# EAGLE design Transconductance Card (EAGLE 9.6.2)

## Sheet 1 of 4
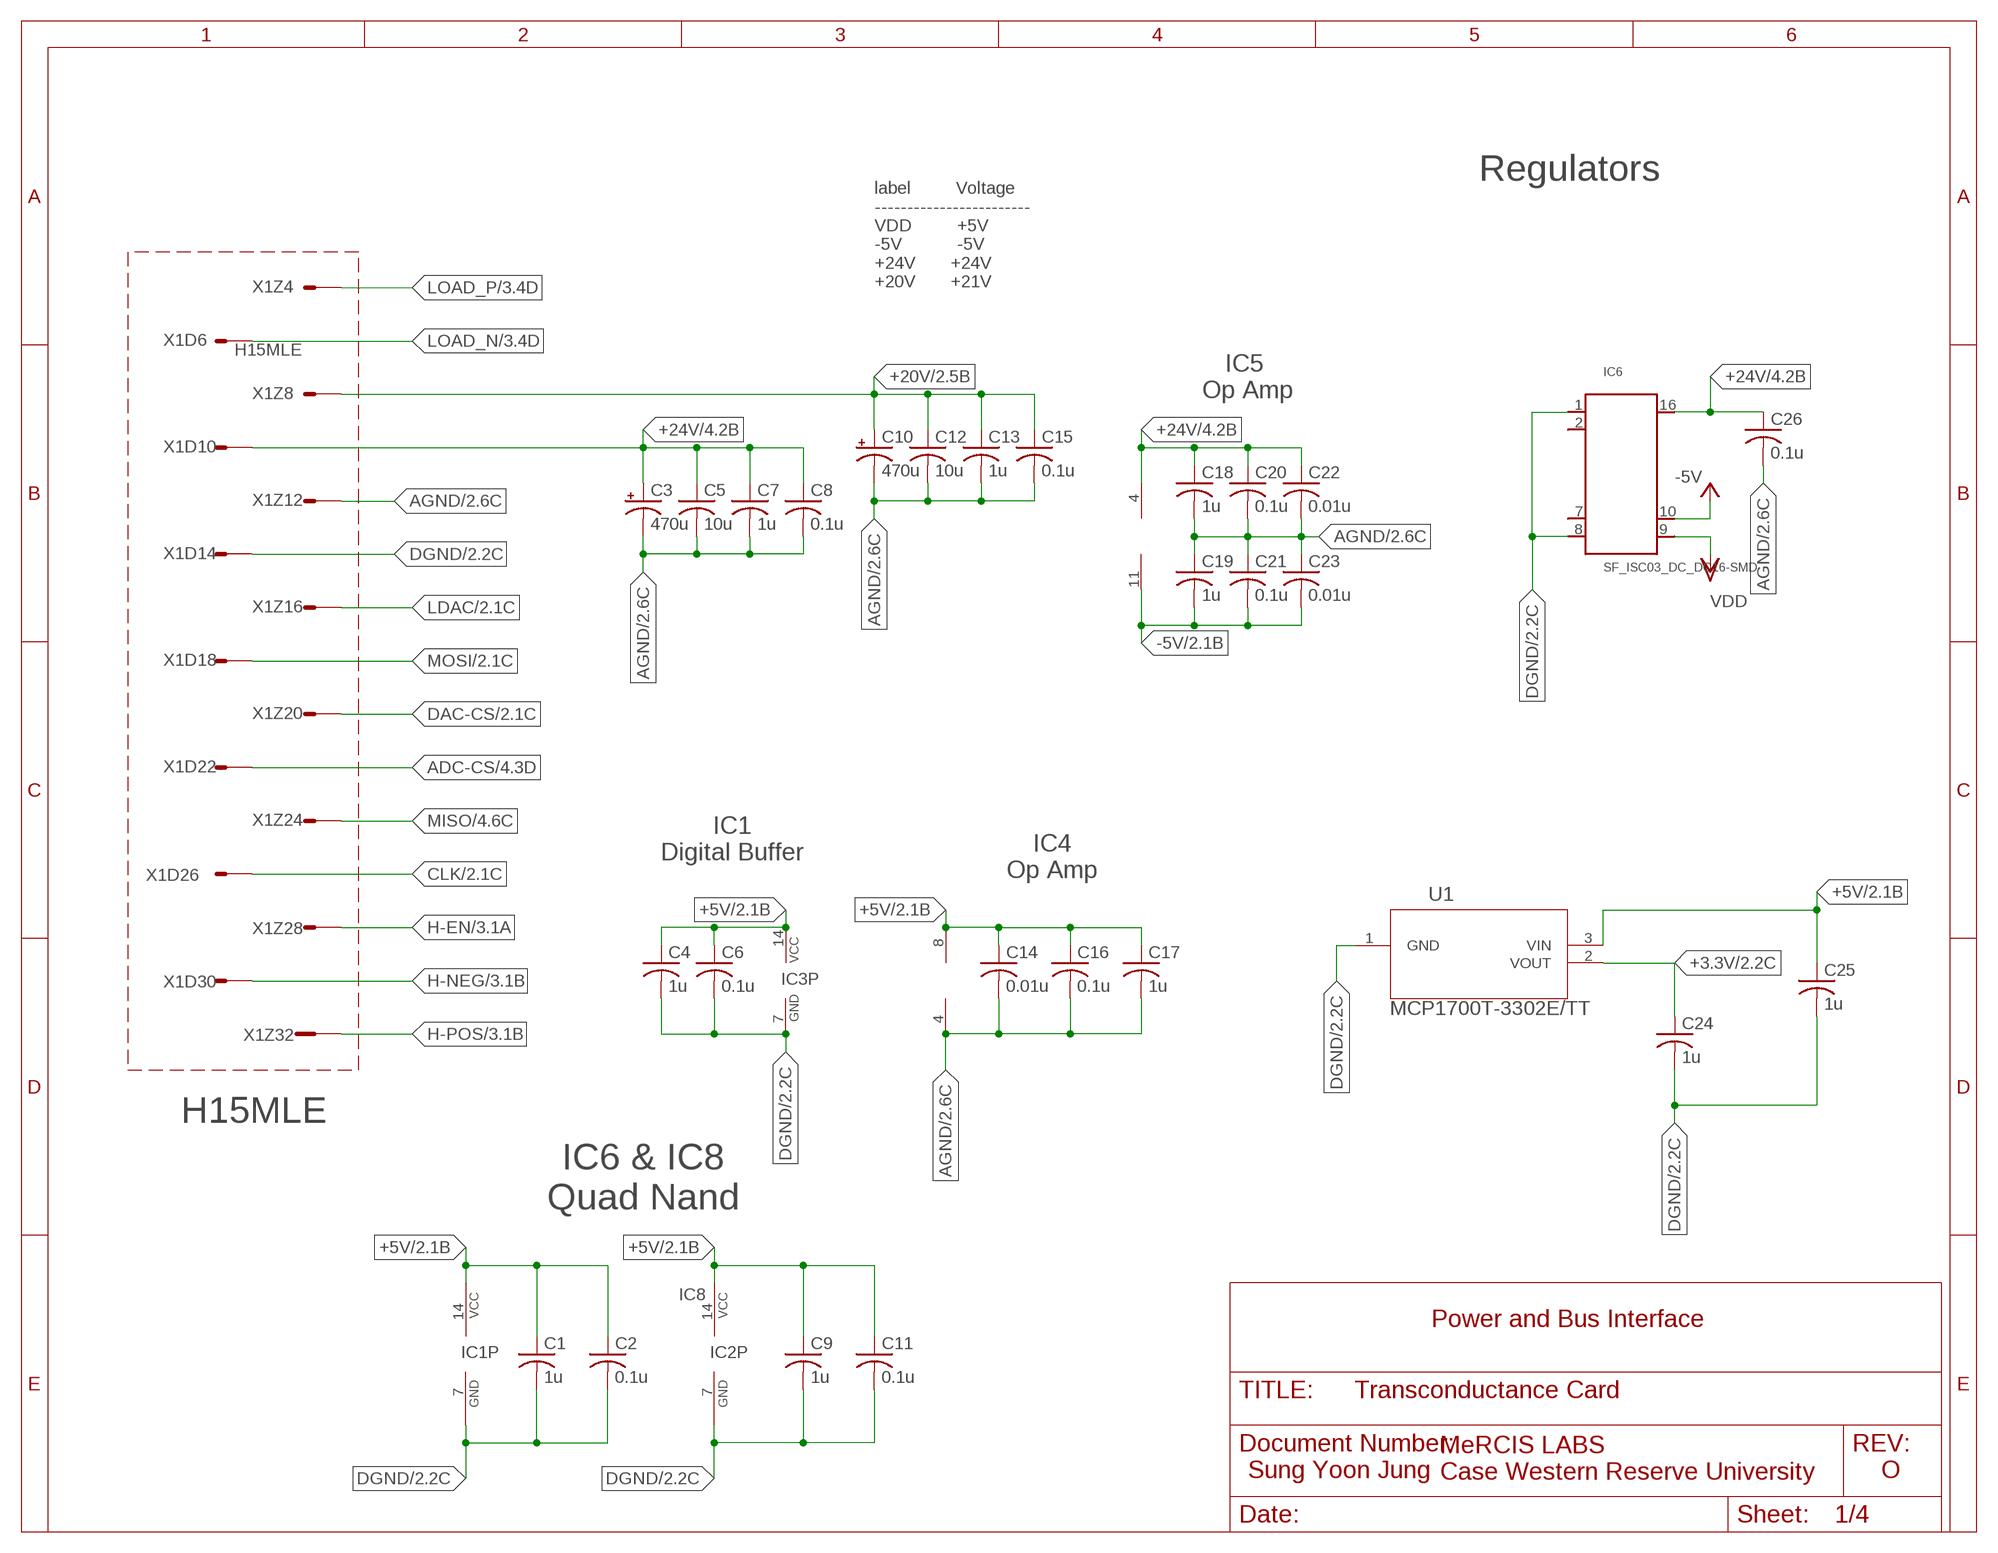
[diagram p0: schematic, sheet 1]

### Parts
C1  1u  CAPACITORC0805  [C0805]
C2  0.1u  CAPACITORC0805  [C0805]
C3  470u  CPOL-US140CLH-1010  [140CLH-1010]
C4  1u  CAPACITORC0805  [C0805]
C5  10u  C-USC1210  [C1210]
C6  0.1u  CAPACITORC0805  [C0805]
C7  1u  CAPACITORC0805  [C0805]
C8  0.1u  CAPACITORC0805  [C0805]
C9  1u  CAPACITORC0805  [C0805]
C10  470u  CPOL-US140CLH-1010  [140CLH-1010]
C11  0.1u  CAPACITORC0805  [C0805]
C12  10u  C-USC1210  [C1210]
C13  1u  CAPACITORC0805  [C0805]
C14  0.01u  CAPACITORC0805  [C0805]
C15  0.1u  CAPACITORC0805  [C0805]
C16  0.1u  CAPACITORC0805  [C0805]
C17  1u  CAPACITORC0805  [C0805]
C18  1u  CAPACITORC0805  [C0805]
C19  1u  CAPACITORC0805  [C0805]
C20  0.1u  CAPACITORC0805  [C0805]
C21  0.1u  CAPACITORC0805  [C0805]
C22  0.01u  CAPACITORC0805  [C0805]
C23  0.01u  CAPACITORC0805  [C0805]
C24  1u  CAPACITORC0805  [C0805]
C25  1u  CAPACITORC0805  [C0805]
C26  0.1u  CAPACITORC0805  [C0805]
IC1  74LS00  74LS00_QUAD_NANDD  [74XX-US_SO14:1]
IC2  74LS00  74ALS00_QUAD_NANDD  [74XX-US_SO14:1]
IC3  74LS07D  [SO14]
IC4  TLC272D  [SO08]
IC5  OP484  LM324D  [SO14]
IC6  SF_ISC03_DC_DC16-SMD  [SF_ISC03_SOP254P1879X863-16N]
U1  MCP1700T-3302E/TT  [SOT-23_MC]
X1  H15MLE  [H15ML]

### Nets
+3.3V: C24.1 U1.2(VOUT) ; also sheet 2,4
+5V: C1.1 C2.1 C4.1 C6.1 C9.1 C11.1 C14.1 C16.1 C17.1 C25.1 IC1.14(P:VCC) IC2.14(P:VCC) IC3.14(P:VCC) IC4.8(P:V+) IC6.9 U1.3(VIN) ; supply symbol labelled VDD ; also sheet 2,3,4
+20V: C10.+ C12.1 C13.1 C15.1 X1.Z8 ; also sheet 2,4
+24V: C3.+ C5.1 C7.1 C8.1 C18.1 C20.1 C22.1 C26.1 IC5.4(P:V+) IC6.16 X1.D10 ; also sheet 4
-5V: C19.2 C21.2 C23.2 IC5.11(P:V-) IC6.10 ; also sheet 2,4
ADC-CS: X1.D22 ; also sheet 4
AGND: C3.- C5.2 C7.2 C8.2 C10.- C12.2 C13.2 C14.2 C15.2 C16.2 C17.2 C18.2 C19.1 C20.2 C21.1 C22.2 C23.1 C26.2 IC4.4(P:V-) X1.Z12 ; also sheet 2,3,4
CLK: X1.D26 ; also sheet 2,4
DAC-CS: X1.Z20 ; also sheet 2
DGND: C1.2 C2.2 C4.2 C6.2 C9.2 C11.2 C24.2 C25.2 IC1.7(P:GND) IC2.7(P:GND) IC3.7(P:GND) IC6.1 IC6.8 U1.1(GND) X1.D14 ; also sheet 2,3,4
H-EN: X1.Z28 ; also sheet 3
H-NEG: X1.D30 ; also sheet 3
H-POS: X1.Z32 ; also sheet 3
LDAC: X1.Z16 ; also sheet 2
LOAD_N: X1.D6 ; also sheet 3
LOAD_P: X1.Z4 ; also sheet 3
MISO: X1.Z24 ; also sheet 4
MOSI: X1.D18 ; also sheet 2
Unconnected: IC4.5(B:+IN) IC4.6(B:-IN) IC4.7(B:OUT) IC5.1(A:OUT) IC5.2(A:-IN) IC5.3(A:+IN) IC5.5(B:+IN) IC5.6(B:-IN) IC5.7(B:OUT) IC6.2 IC6.7

### Notes on the sheet
- Regulators
- label         Voltage
  ------------------------
  VDD         +5V
  -5V           -5V
  +24V       +24V
  +20V       +21V
- IC5 
  Op Amp
- IC1
  Digital Buffer
- IC4
  Op Amp
- H15MLE
- IC6 & IC8
  Quad Nand
- IC8
- Power and Bus Interface
- O
- Sung Yoon Jung
- MeRCIS LABS
  Case Western Reserve University

## Sheet 2 of 4
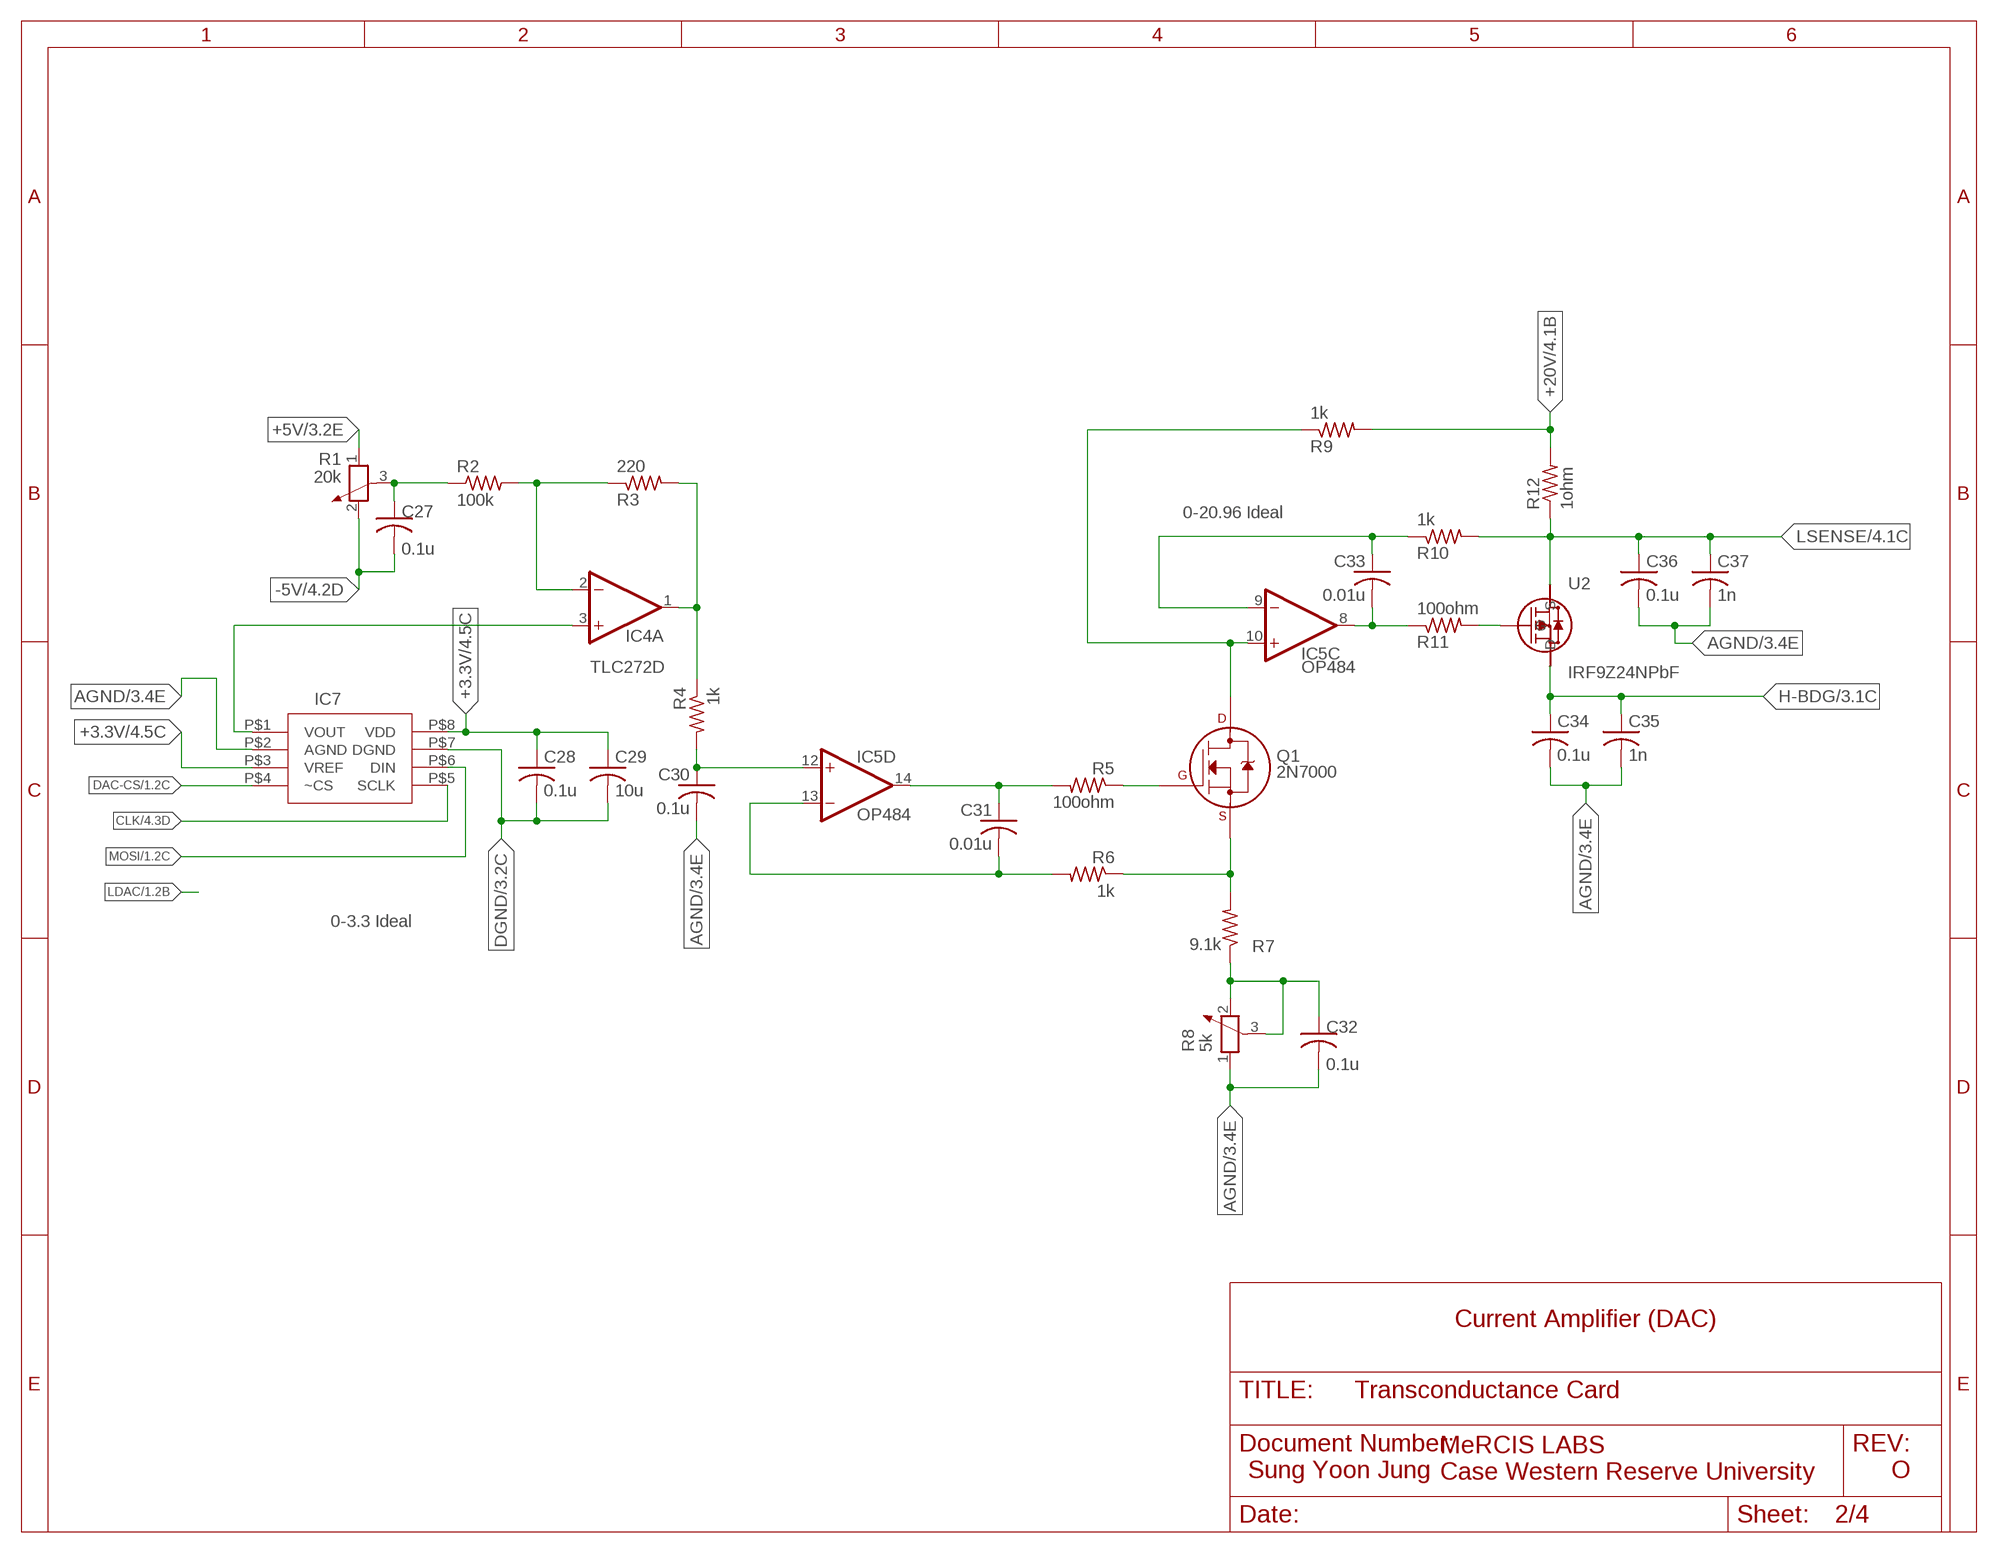
[diagram p1: schematic, sheet 2]

### Parts
C27  0.1u  CAPACITORC0805  [C0805]
C28  0.1u  CAPACITORC0805  [C0805]
C29  10u  CAPACITORC0805  [C0805]
C30  0.1u  CAPACITORC0805  [C0805]
C31  0.01u  CAPACITORC0805  [C0805]
C32  0.1u  CAPACITORC0805  [C0805]
C33  0.01u  CAPACITORC0805  [C0805]
C34  0.1u  CAPACITORC0805  [C0805]
C35  1n  CAPACITORC0805  [C0805]
C36  0.1u  CAPACITORC0805  [C0805]
C37  1n  CAPACITORC0805  [C0805]
IC7  AD5551  [SO-8]
Q1  2N7000  2N7002_SOT23  [SOT-23]
R1  20k  POTENTIOMETER_PT_SPIN  [PT-SPIN]
R2  100k  R-US_M1206  [M1206]
R3  220  R-US_M1206  [M1206]
R4  1k  R-US_M1206  [M1206]
R5  100ohm  R-US_M1206  [M1206]
R6  1k  R-US_M1206  [M1206]
R7  9.1k  R-US_M1206  [M1206]
R8  5k  POTENTIOMETER_PT_SPIN  [PT-SPIN]
R9  1k  R-US_M1206  [M1206]
R10  1k  R-US_M1206  [M1206]
R11  100ohm  R-US_M1206  [M1206]
R12  1ohm  R-US_R2512  [R2512]
U2  IRF9Z24NPbF  UL_IRF9Z24_IRF9Z24SPBF  [UL_IRF9Z24_D2PAK]

### Nets
+3.3V: C28.1 C29.1 IC7.P$3(VREF) IC7.P$8(VDD) ; also sheet 1,4
+5V: R1.1 ; also sheet 1,3,4
+20V: R9.2 R12.2 ; also sheet 1,4
-5V: C27.2 R1.2 ; also sheet 1,4
AGND: C30.2 C32.2 C34.2 C35.2 C36.2 C37.2 IC7.P$2(AGND) R8.1 ; also sheet 1,3,4
CLK: IC7.P$5(SCLK) ; also sheet 1,4
DAC-CS: IC7.P$4(~CS) ; also sheet 1
DGND: C28.2 C29.2 IC7.P$7(DGND) ; also sheet 1,3,4
H-BDG: C34.1 C35.1 U2.2(D) ; also sheet 3
LSENSE: C36.1 C37.1 R10.2 R12.1 U2.3(S) ; also sheet 4
MOSI: IC7.P$6(DIN) ; also sheet 1
N$2: Q1.2(S) R6.1 R7.2
N$5: Q1.1(G) R5.1
N$9: C31.1 IC5.14(D:OUT) R5.2
N$10: IC4.3(A:+IN) IC7.P$1(VOUT)
N$11: IC5.10(C:+IN) Q1.3(D) R9.1
N$13: R11.2 U2.1(G)
N$14: C31.2 IC5.13(D:-IN) R6.2
N$15: C33.2 IC5.8(C:OUT) R11.1
N$17: C30.1 IC5.12(D:+IN) R4.2
N$18: C32.1 R7.1 R8.2 R8.3
N$20: C33.1 IC5.9(C:-IN) R10.1
N$21: C27.1 R1.3 R2.1
N$28: IC4.1(A:OUT) R3.2 R4.1
N$37: IC4.2(A:-IN) R2.2 R3.1

### Notes on the sheet
- 0-20.96 Ideal
- 0-3.3 Ideal
- Current Amplifier (DAC)
- Sung Yoon Jung | O
- MeRCIS LABS
  Case Western Reserve University

## Sheet 3 of 4
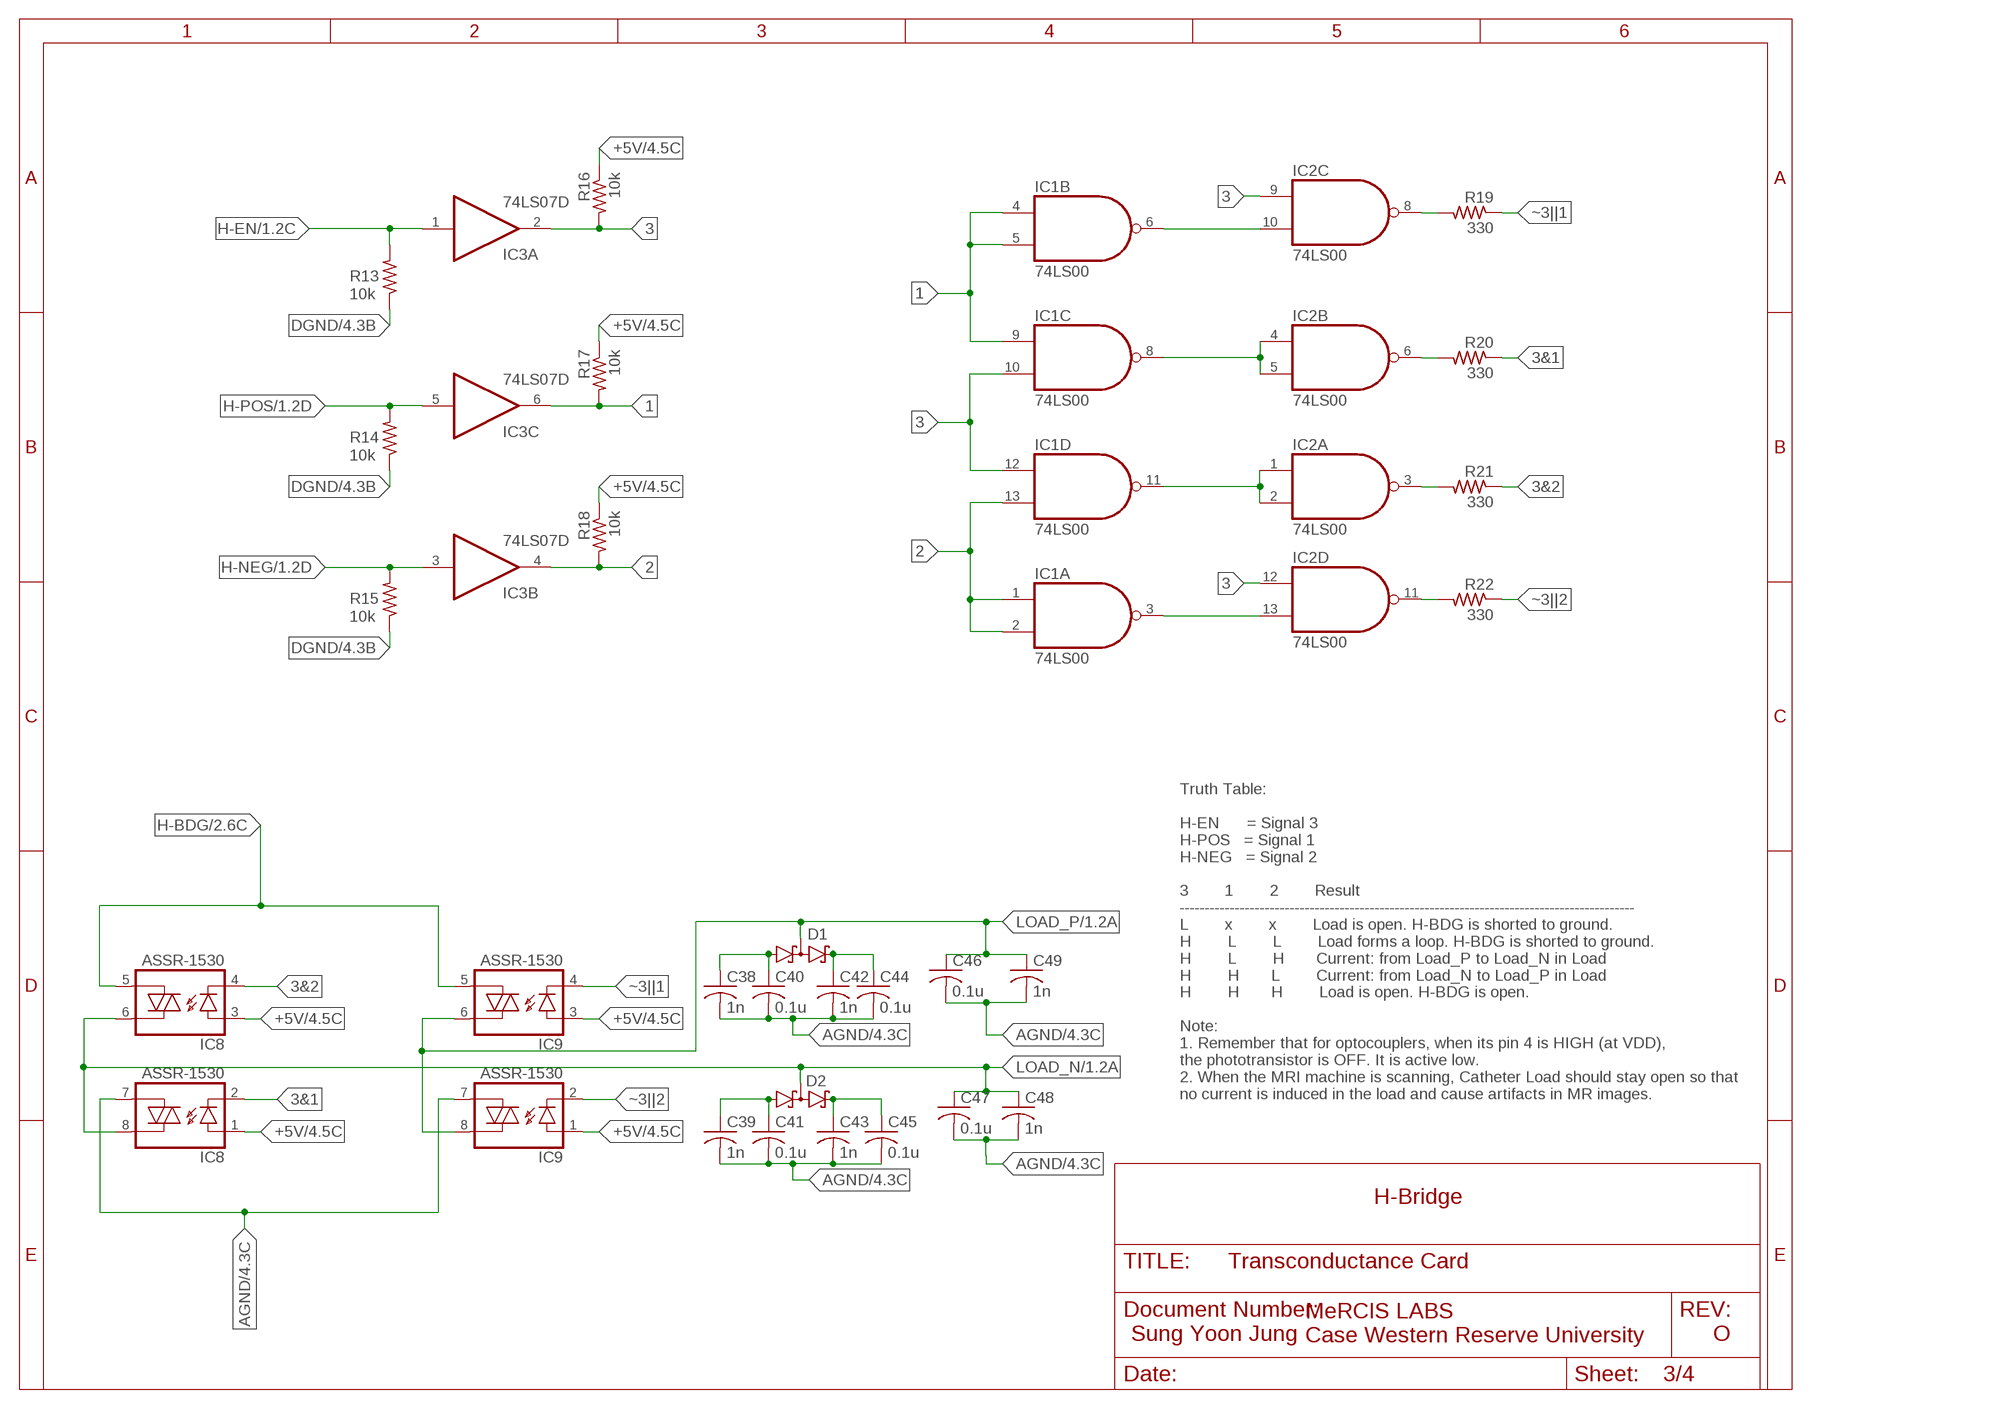
[diagram p2: schematic, sheet 3]

### Parts
C38  1n  C-USC1206  [C1206]
C39  1n  C-USC1206  [C1206]
C40  0.1u  C-USC1210  [C1210]
C41  0.1u  C-USC1210  [C1210]
C42  1n  C-USC1206  [C1206]
C43  1n  C-USC1206  [C1206]
C44  0.1u  C-USC1210  [C1210]
C45  0.1u  C-USC1210  [C1210]
C46  0.1u  C-USC1210  [C1210]
C47  0.1u  C-USC1210  [C1210]
C48  1n  C-USC1206  [C1206]
C49  1n  C-USC1206  [C1206]
D1  BAS70-04  [SOT23]
D2  BAS70-04  [SOT23]
IC8  ASSR-1530  ASSR-1530_SSR  [ASSR-1530_SO8]
IC9  ASSR-1530  ASSR-1530_SSR  [ASSR-1530_SO8]
R13  10k  R-US_M1206  [M1206]
R14  10k  R-US_M1206  [M1206]
R15  10k  R-US_M1206  [M1206]
R16  10k  R-US_M1206  [M1206]
R17  10k  R-US_M1206  [M1206]
R18  10k  R-US_M1206  [M1206]
R19  330  R-US_M1206  [M1206]
R20  330  R-US_M1206  [M1206]
R21  330  R-US_M1206  [M1206]
R22  330  R-US_M1206  [M1206]

### Nets
1: IC1.4(B:I0) IC1.5(B:I1) IC1.9(C:I0) IC3.6(C:O) R17.2
2: IC1.1(A:I0) IC1.2(A:I1) IC1.13(D:I1) IC3.4(B:O) R18.2
3: IC1.10(C:I1) IC1.12(D:I0) IC2.9(C:I0) IC2.12(D:I0) IC3.2(A:O) R16.2
3&1: IC8.2 R20.1
3&2: IC8.4 R21.1
+5V: IC8.1 IC8.3 IC9.1 IC9.3 R16.1 R17.1 R18.1 ; also sheet 1,2,4
AGND: C38.2 C39.2 C40.2 C41.2 C42.2 C43.2 C44.2 C45.2 C46.2 C47.2 C48.2 C49.2 IC8.7 IC9.7 ; also sheet 1,2,4
DGND: R13.1 R14.1 R15.1 ; also sheet 1,2,4
H-BDG: IC8.5 IC9.5 ; also sheet 2
H-EN: IC3.1(A:I) R13.2 ; also sheet 1
H-NEG: IC3.3(B:I) R15.2 ; also sheet 1
H-POS: IC3.5(C:I) R14.2 ; also sheet 1
LOAD_N: C47.1 C48.1 D2.3(C1A2) IC8.6 IC8.8 ; also sheet 1
LOAD_P: C46.1 C49.1 D1.3(C1A2) IC9.6 IC9.8 ; also sheet 1
N$6: IC1.6(B:O) IC2.10(C:I1)
N$7: IC1.3(A:O) IC2.13(D:I1)
N$16: C38.1 C40.1 D1.1(A1)
N$22: C42.1 C44.1 D1.2(C2)
N$23: IC1.8(C:O) IC2.4(B:I0) IC2.5(B:I1)
N$24: IC1.11(D:O) IC2.1(A:I0) IC2.2(A:I1)
N$25: IC2.8(C:O) R19.2
N$26: IC2.6(B:O) R20.2
N$27: IC2.3(A:O) R21.2
N$29: IC2.11(D:O) R22.2
N$30: C39.1 C41.1 D2.1(A1)
N$32: C43.1 C45.1 D2.2(C2)
~3||1: IC9.4 R19.1
~3||2: IC9.2 R22.1

### Notes on the sheet
- Truth Table:
  
  H-EN      = Signal 3
  H-POS   = Signal 1
  H-NEG   = Signal 2
  
  3        1        2        Result
  -------------------------------------------------------------------------------------------
  L        x        x        Load is open. H-BDG is shorted to ground.
  H        L        L        Load forms a loop. H-BDG is shorted to ground.
  H        L        H       Current: from Load_P to Load_N in Load
  H        H       L        Current: from Load_N to Load_P in Load
  H        H       H        Load is open. H-BDG is open.
  
  Note:
  1. Remember that for optocouplers, when its pin 4 is HIGH (at VDD), 
  the phototransistor is OFF. It is active low.
  2. When the MRI machine is scanning, Catheter Load should stay open so that 
  no current is induced in the load and cause artifacts in MR images.
- H-Bridge
- Sung Yoon Jung | O
- MeRCIS LABS
  Case Western Reserve University

## Sheet 4 of 4
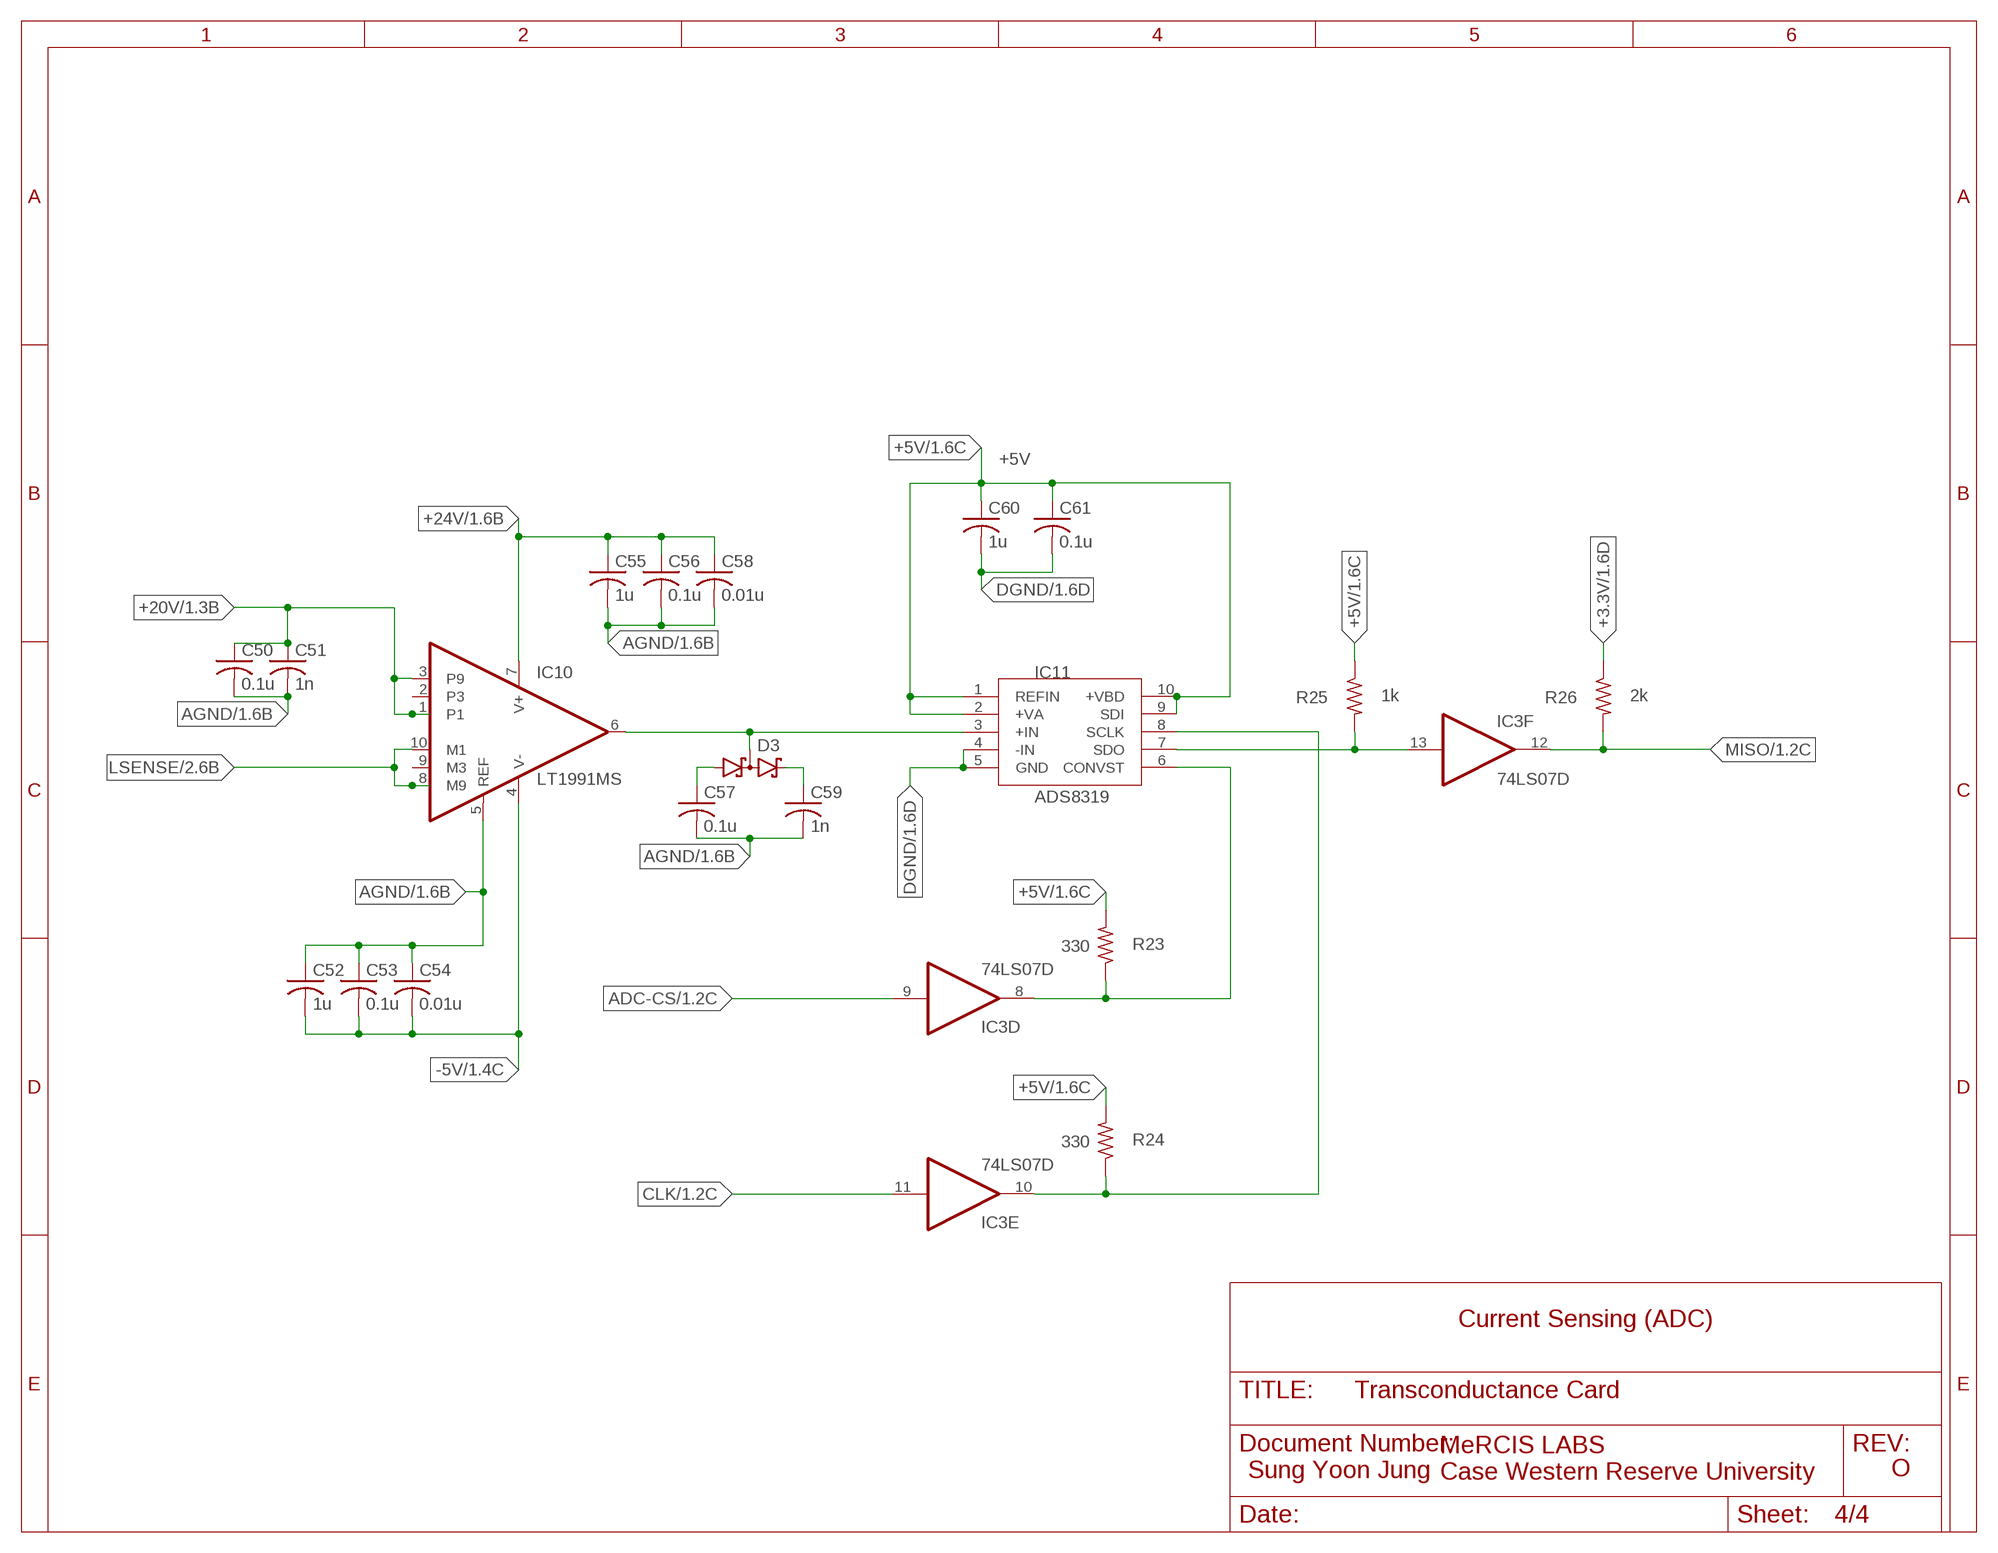
[diagram p3: schematic, sheet 4]

### Parts
C50  0.1u  C-USC1210  [C1210]
C51  1n  C-USC1206  [C1206]
C52  1u  CAPACITORC0805  [C0805]
C53  0.1u  CAPACITORC0805  [C0805]
C54  0.01u  CAPACITORC0805  [C0805]
C55  1u  CAPACITORC0805  [C0805]
C56  0.1u  CAPACITORC0805  [C0805]
C57  0.1u  CAPACITORC0805  [C0805]
C58  0.01u  CAPACITORC0805  [C0805]
C59  1n  CAPACITORC0805  [C0805]
C60  1u  CAPACITORC0805  [C0805]
C61  0.1u  CAPACITORC0805  [C0805]
D3  BAS70-04  [SOT23]
IC10  LT1991MS  [MSOP10]
IC11  ADS8319  [VSSOP-10]
R23  330  R-US_M1206  [M1206]
R24  330  R-US_M1206  [M1206]
R25  1k  R-US_M1206  [M1206]
R26  2k  R-US_M1206  [M1206]

### Nets
+3.3V: R26.1 ; also sheet 1,2
+5V: C60.1 C61.1 IC11.1(REFIN) IC11.2(+VA) IC11.9(SDI) IC11.10(+VBD) R23.2 R24.2 R25.1 ; also sheet 1,2,3
+20V: C50.1 C51.1 IC10.1 IC10.3(P9) ; also sheet 1,2
+24V: C55.1 C56.1 C58.1 IC10.7(V+) ; also sheet 1
-5V: C52.2 C53.2 C54.2 IC10.4(V-) ; also sheet 1,2
ADC-CS: IC3.9(D:I) ; also sheet 1
AGND: C50.2 C51.2 C52.1 C53.1 C54.1 C55.2 C56.2 C57.2 C58.2 C59.2 IC10.5(REF) ; also sheet 1,2,3
CLK: IC3.11(E:I) ; also sheet 1,2
DGND: C60.2 C61.2 IC11.4(-IN) IC11.5(GND) ; also sheet 1,2,3
LSENSE: IC10.8(M9) IC10.10(M1) ; also sheet 2
MISO: IC3.12(F:O) R26.2 ; also sheet 1
N$1: D3.3(C1A2) IC10.6(OUT) IC11.3(+IN)
N$3: IC3.8(D:O) IC11.6(CONVST) R23.1
N$4: IC3.10(E:O) IC11.8(SCLK) R24.1
N$8: IC3.13(F:I) IC11.7(SDO) R25.2
N$33: C57.1 D3.1(A1)
N$34: C59.1 D3.2(C2)
Unconnected: IC10.2(P3) IC10.9(M3)

### Notes on the sheet
- Current Sensing (ADC)
- Sung Yoon Jung | O
- MeRCIS LABS
  Case Western Reserve University

## Library data of the parts
C1 C2 C4 C6-C9 C11 C13-C37 C52-C61 = MeRCIS Lab Parts:CAPACITOR: CAPACITOR, American symbol; SPICEPREFIX: C
C3 C10 = rcl:CPOL-US: POLARIZED CAPACITOR, American symbol; SPICEPREFIX: C
C5 C12 C38-C51 = resistor:C-US: CAPACITOR, American symbol
D1-D3 = diode:BAS70-04: Silicon Schottky Diodes General-purpose diode for high-speed switching
IC1 IC2 = MeRCIS Lab Parts:74*00_QUAD_NAND: Quad 2-input NAND gate
IC3 = 74xx-eu:74*07: Hex BUFFER, open collector high-voltage output
IC4 = linear:TLC272: OP AMP; SPICEPREFIX: I
IC5 = linear:LM324: OP AMP
IC6 = MeRCIS Lab Parts:SF_ISC03_DC_DC
IC7 = MeRCIS Lab Parts:AD5551
IC8 IC9 = MeRCIS Lab Parts:ASSR-1530_SSR
IC10 = linear-technology:LT1991: Precision 100μA Gain Selectable Amplifier Data sheet <http://cds.linear.com/docs/en/datasheet/1991fh.pdf>
IC11 = MeRCIS Lab Parts:ADS8319
Q1 = UL_2N7002:2N700*: 2N7000, 2N7002, NDS7002A N-channel enhancement mode MOSFET
R1 R8 = rcl:POTENTIOMETER_: Potentiometer; SPICEMODEL: POT; SPICEPREFIX: X
R2-R7 R9-R26 = resistor:R-US_: RESISTOR, American symbol
U1 = UL_MCP1700:MCP1700T-3302E/TT; MANUFACTURER_PART_NUMBER: MCP1700T3302ETT; VENDOR: Microchip
U2 = MeRCIS Lab Parts:UL_IRF9Z24_IRF9Z24SPBF; MANUFACTURER_PART_NUMBER: IRF9Z24SPBF; VENDOR: Vishay
X1 = con-vg:H15MLE: CONNECTOR male, 15 high current pins, single, type H, rows DZ

## Module IC12
Ports: 

### Library data of the parts

## Board
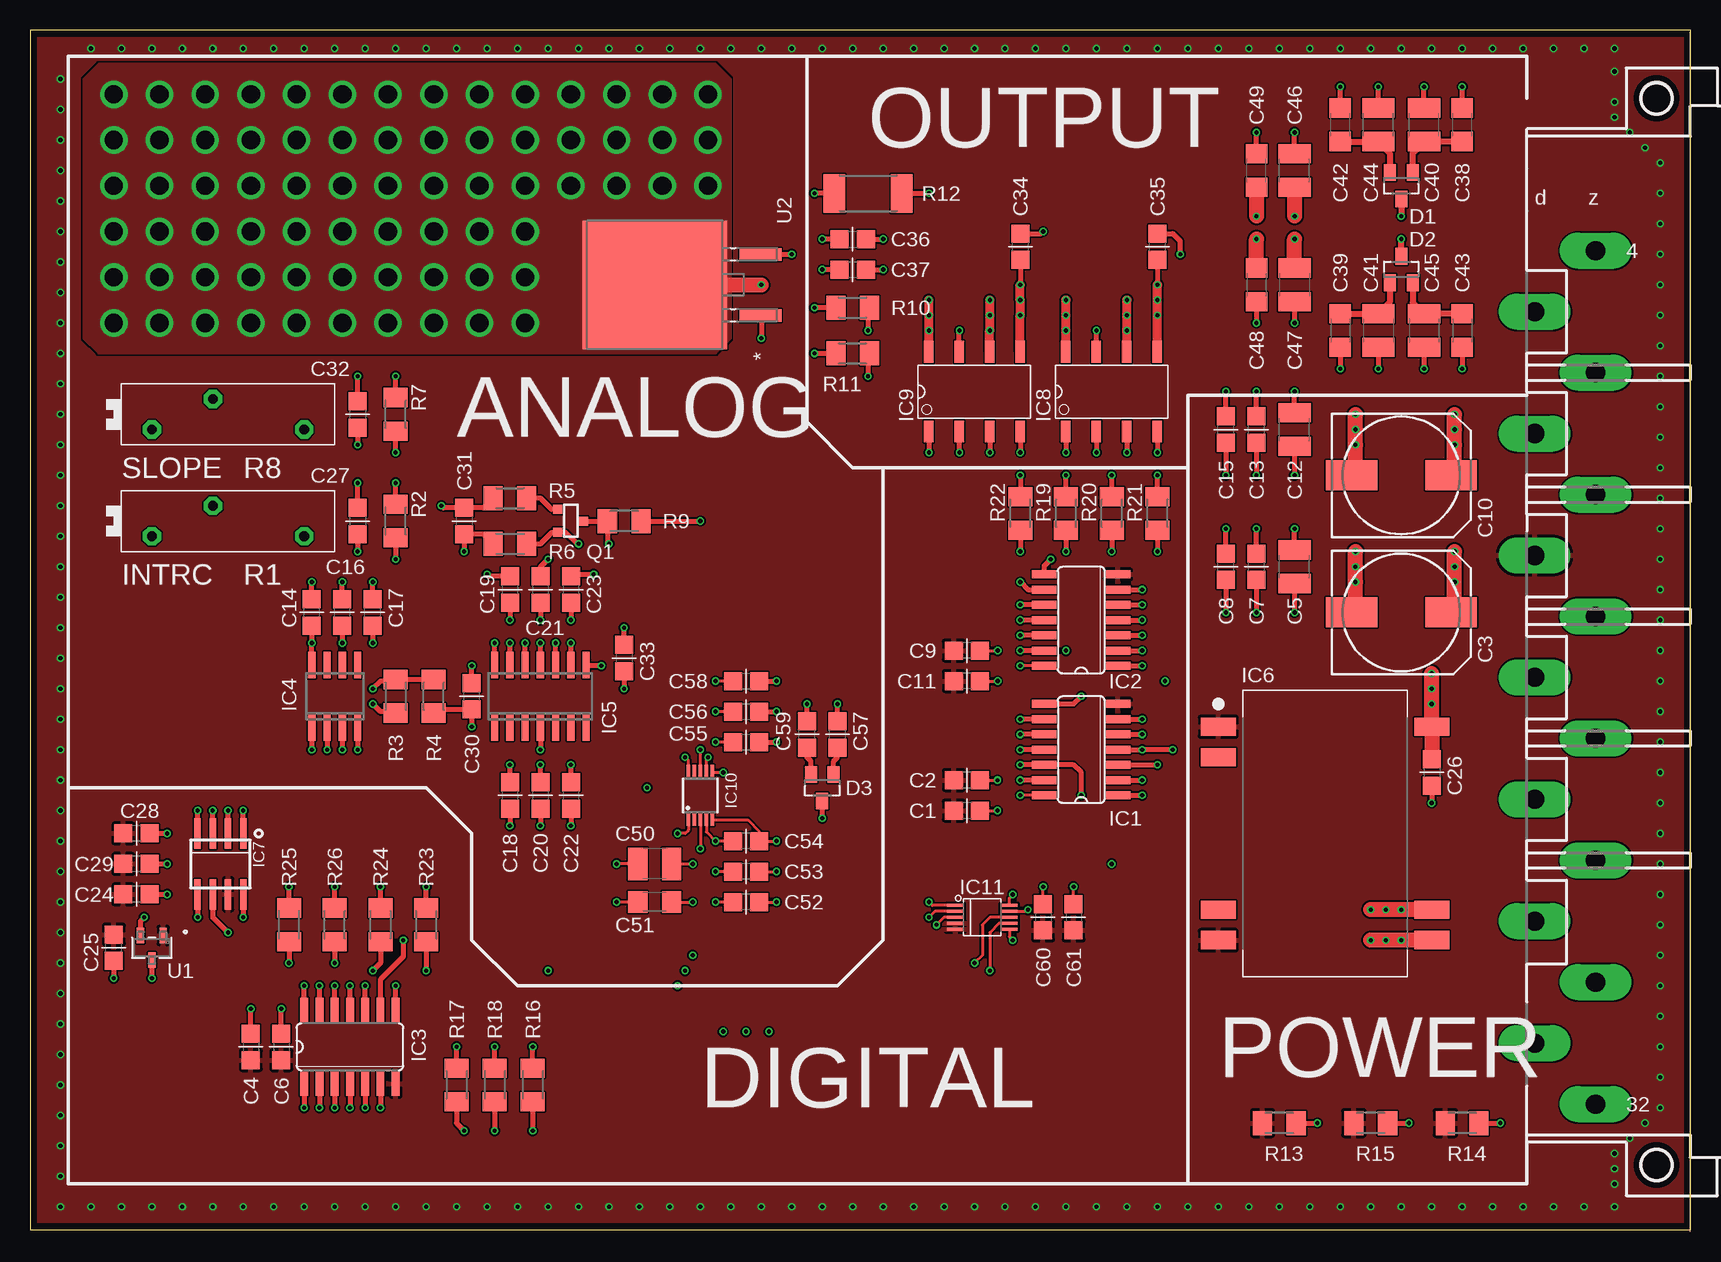
[diagram p4: board, top side]
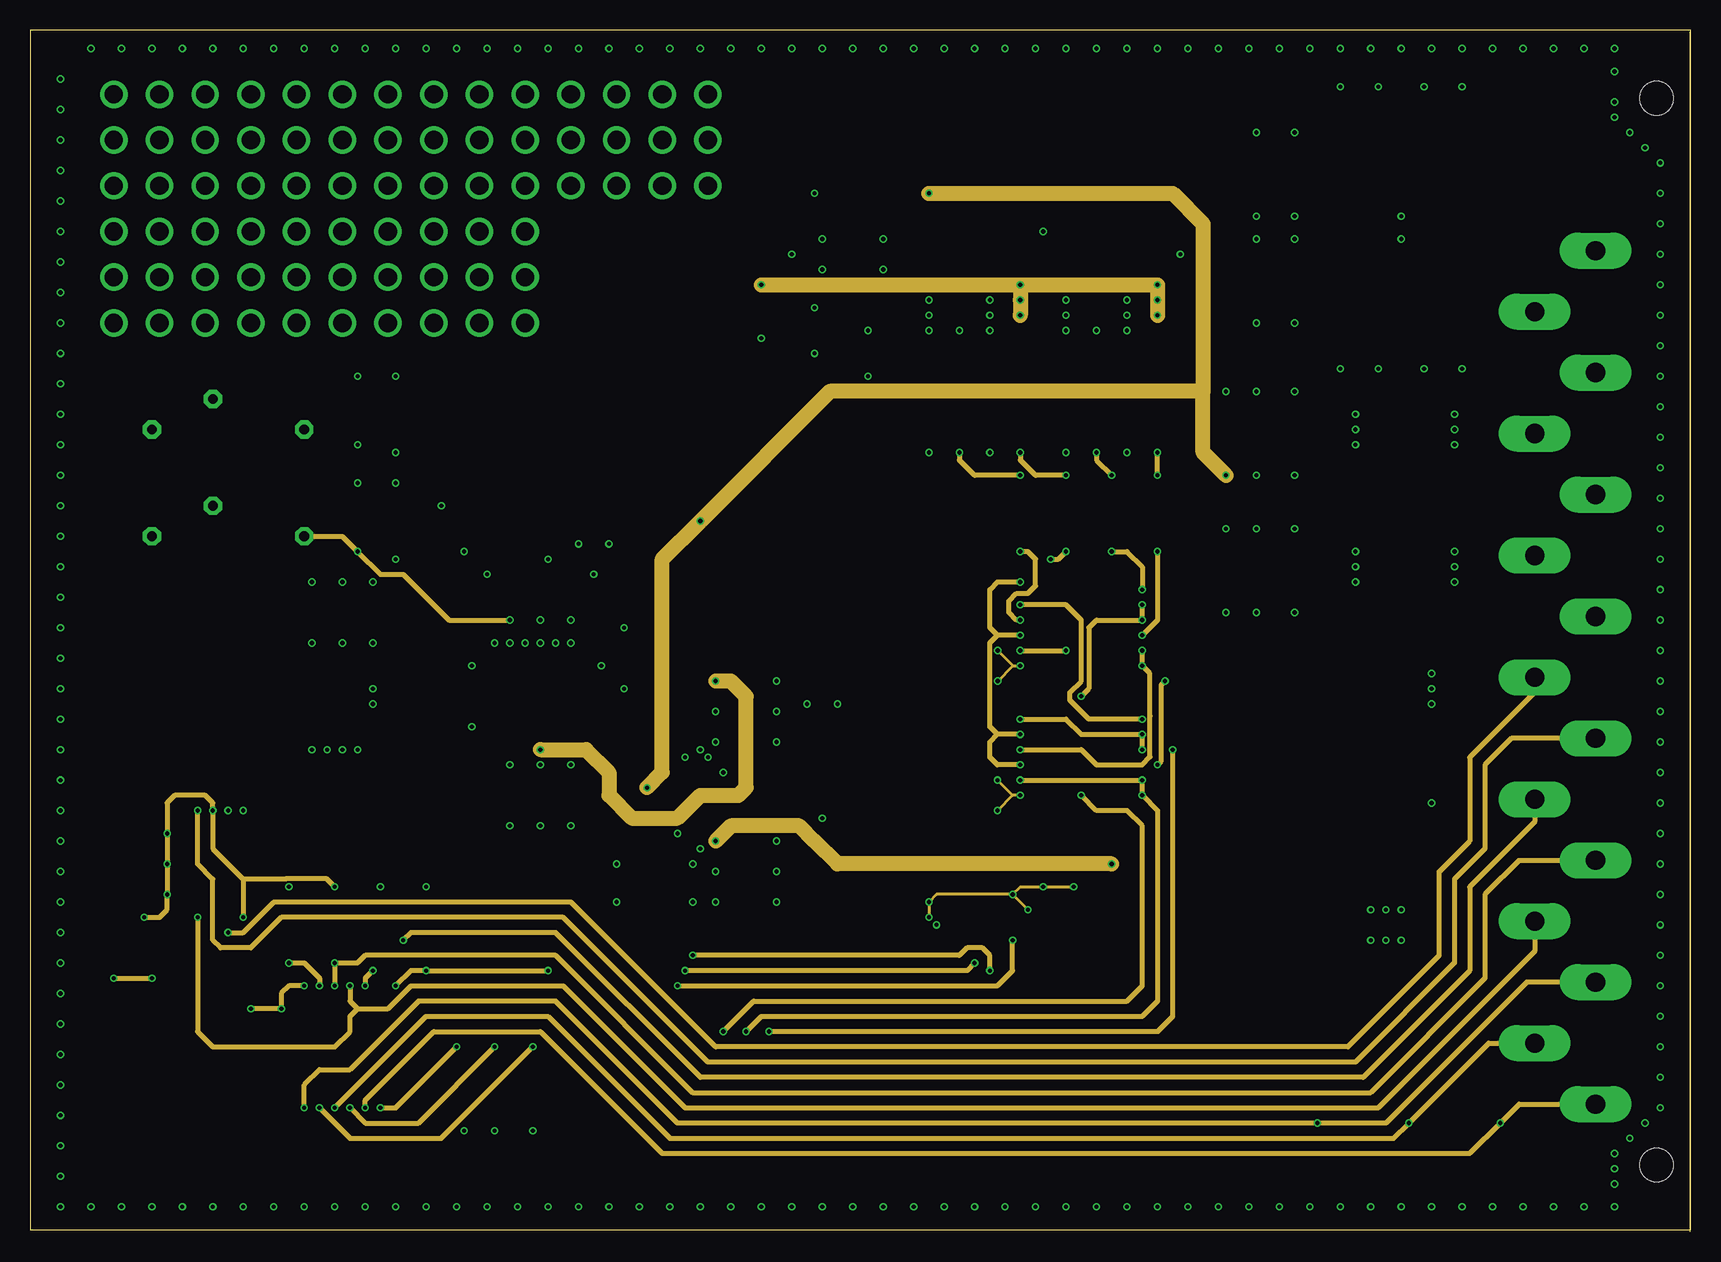
[diagram p5: board, inner layer DigitalSignal]
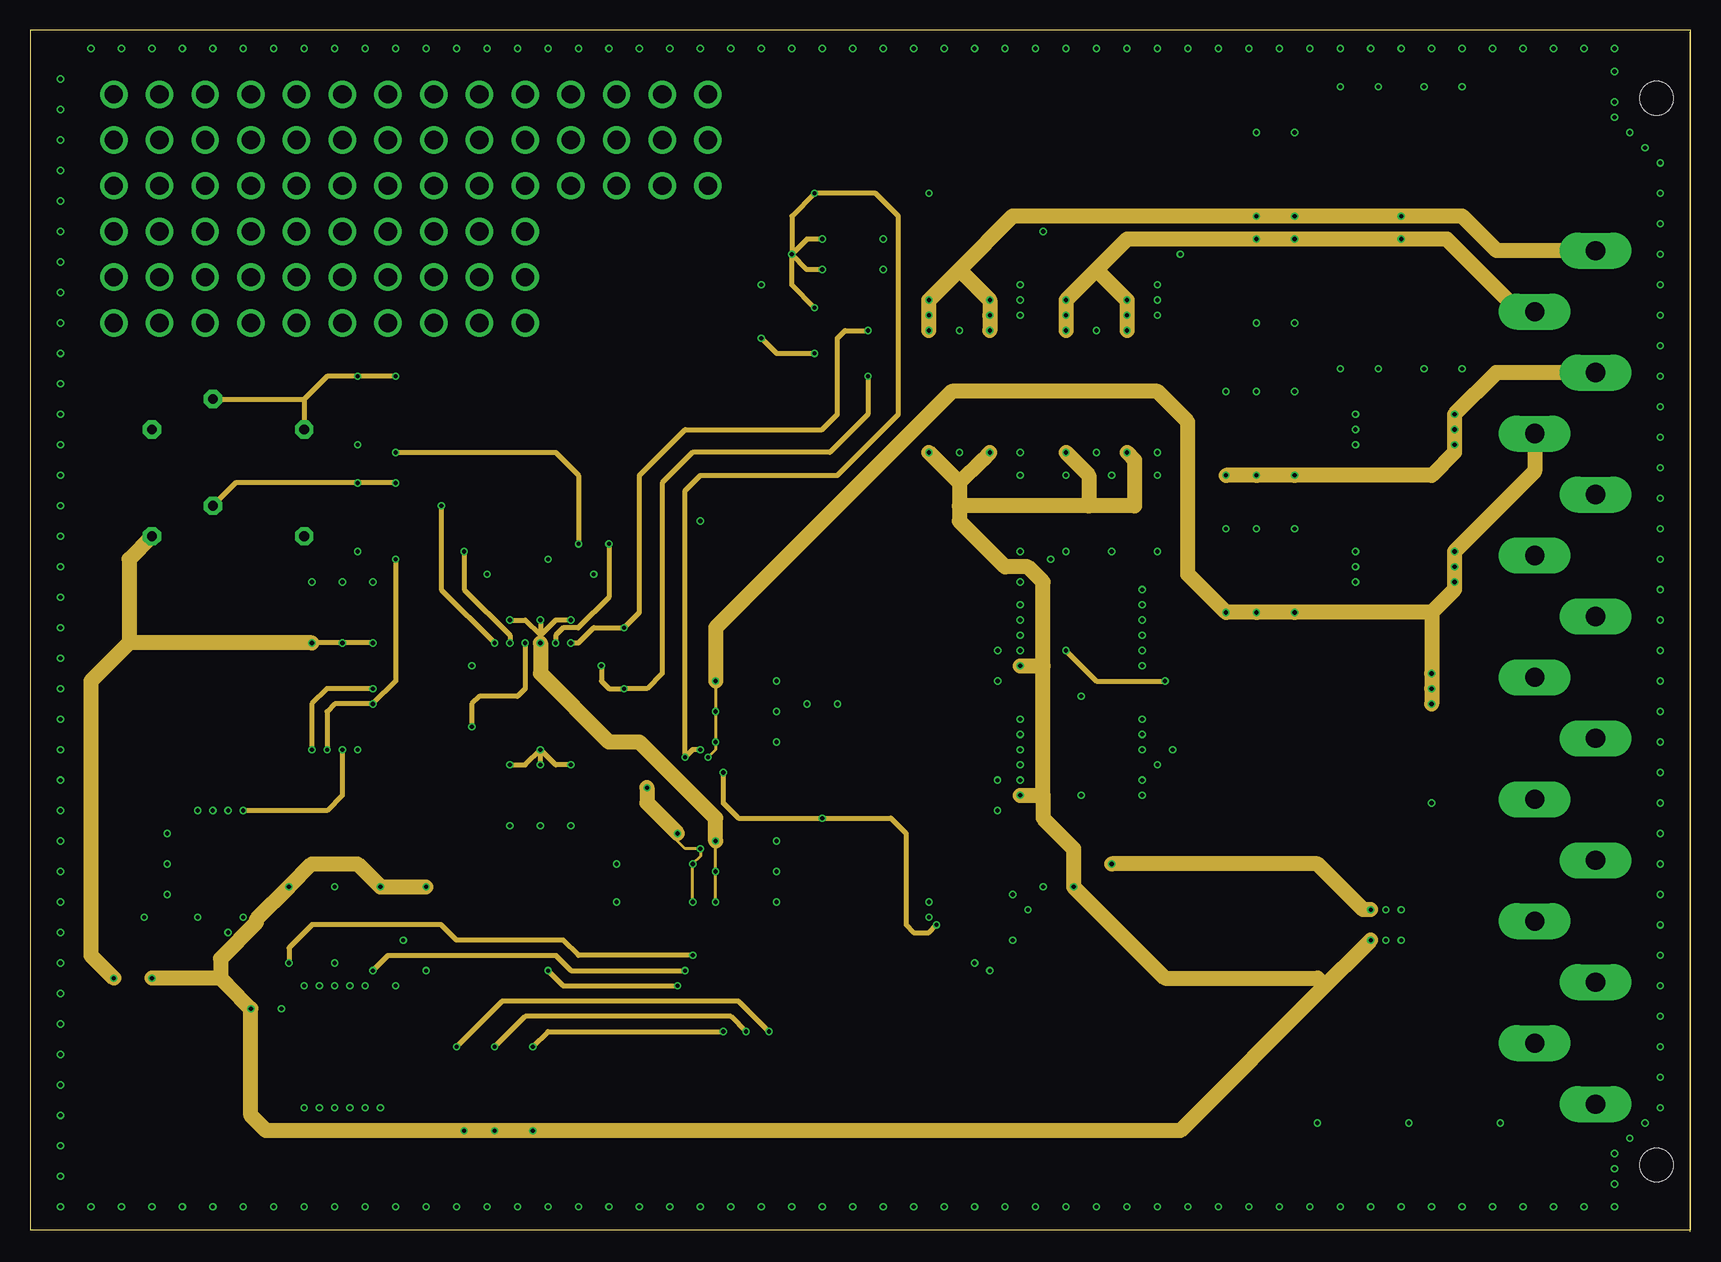
[diagram p6: board, inner layer AnalogSignal]
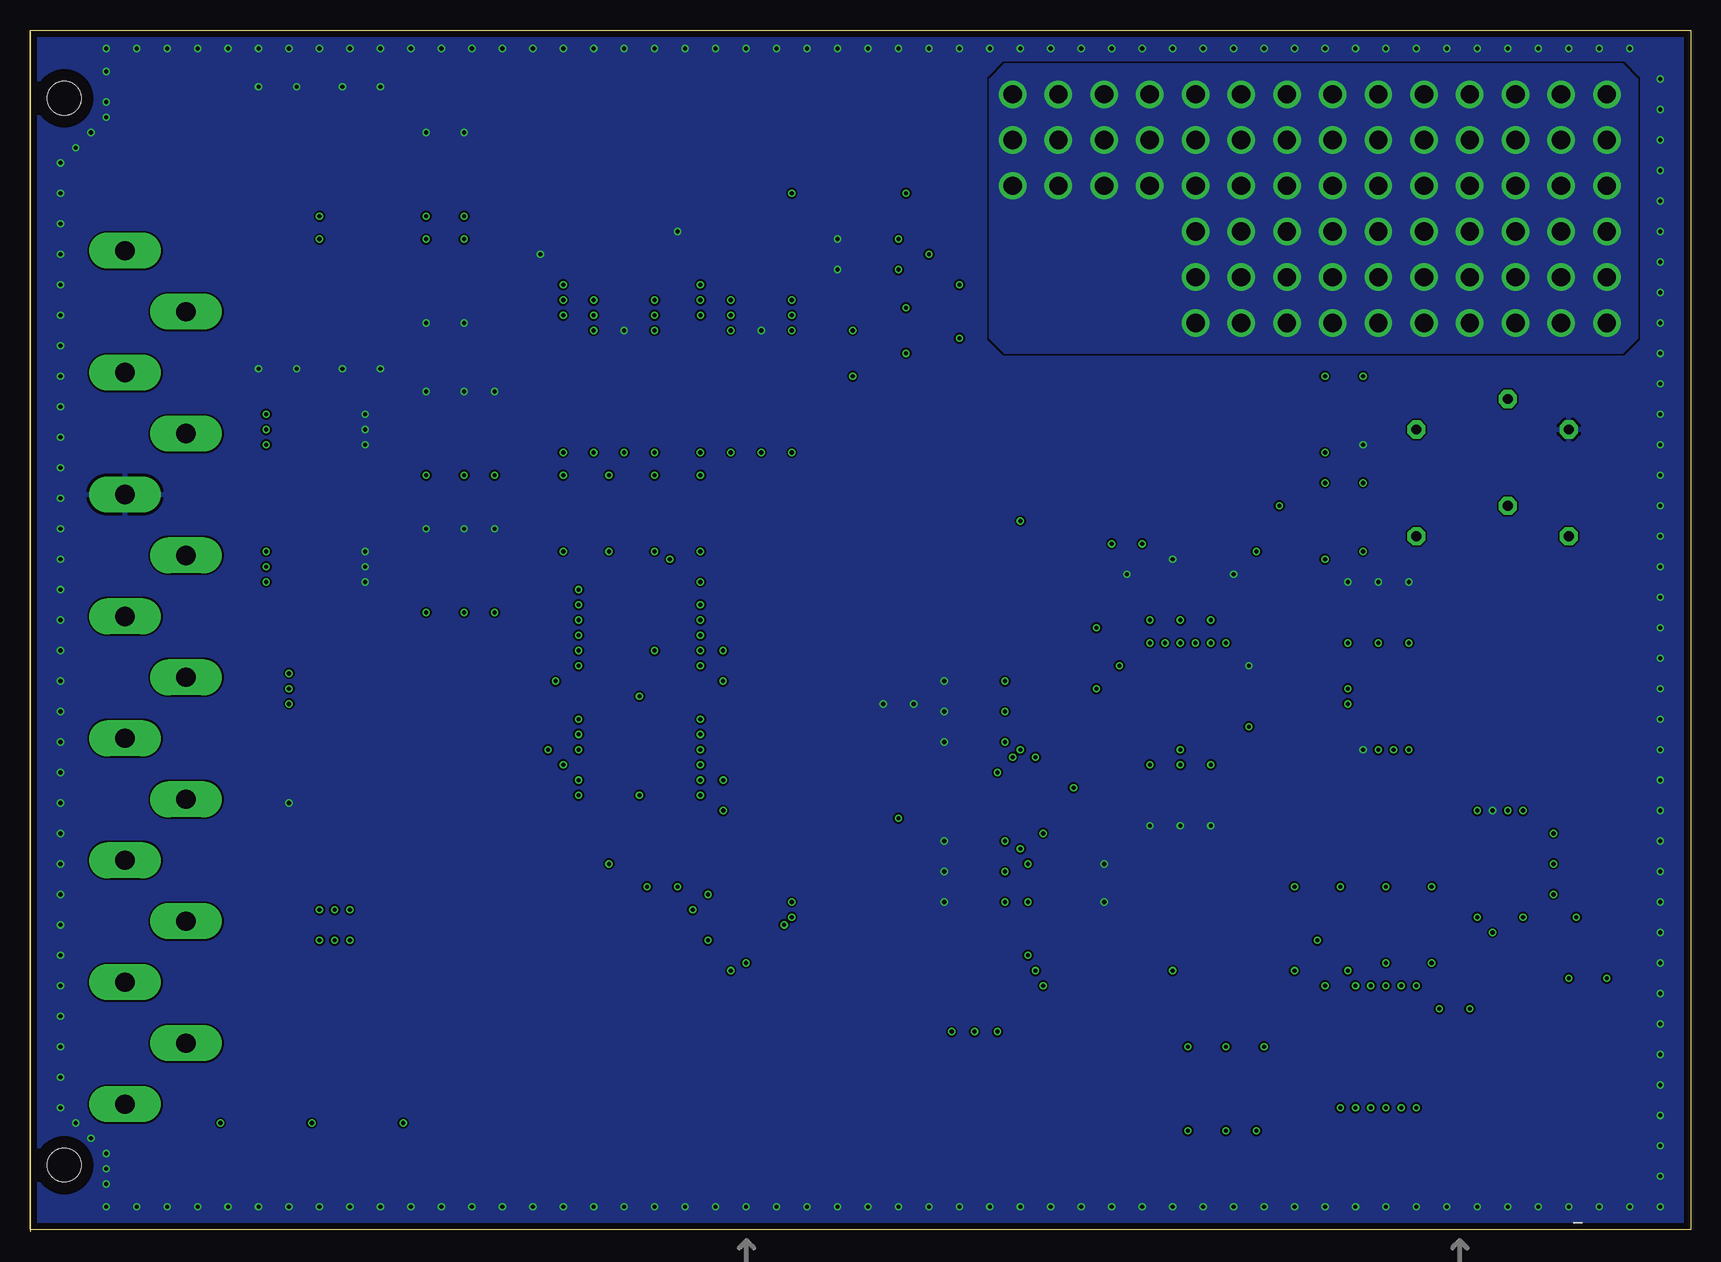
[diagram p7: board, bottom side, seen from below]

Size 138.43 x 99.97 mm. Coordinates in mm from the lower left corner, seen from the top.
Outline: 0,0 138.43,0 138.43,99.97 0,99.97 0,0
Copper layers (1+2*15+16): DigitalGND 0.035559375mm / dielectric 1.6mm / DigitalSignal 0.0356mm / dielectric 0.1499mm / AnalogSignal 0.0356mm / dielectric 0.2007mm / AnalogGND 0.035559375mm
Design rules "Good_Rules_tented_vias *": minimum track width 6mil, minimum drill 10mil, track to track 6mil, track to pad 6mil, pad to pad 6mil, via to via 6mil, smd to smd 6mil, copper to edge 20mil, drill to drill 6mil, minimum pad ring 5mil, minimum via ring 5mil, stop-mask expansion 2.5mil, vias tented up to drill 30mil, thermal gap 10mil

### Footprints (pad centres in the part's own frame; a part is rotated, then mirrored left to right if it is on the bottom)
C0805 = smd 1.5 x 1.5: 1 -1.1,0; 2 1.1,0
140CLH-1010 = smd 4.3 x 2.5: + 4.15,0; - -4.15,0
C1210 = smd 1.6 x 2.7: 1 -1.4,0; 2 1.4,0
C1206 = smd 1.6 x 1.8: 1 -1.4,0; 2 1.4,0
SOT23 = smd 1 x 1.4: 1 -0.95,-1.1; 2 0.95,-1.1; 3 0,1.1
74XX-US_SO14:1 = smd 0.66 x 2.032: 1 -3.81,-3.073; 2 -2.54,-3.073; 3 -1.27,-3.073; 4 0,-3.073; 5 1.27,-3.073; 6 2.54,-3.073; 7 3.81,-3.073; 8 3.81,3.073; 9 2.54,3.073; 10 1.27,3.073; 11 0,3.073; 12 -1.27,3.073; 13 -2.54,3.073; 14 -3.81,3.073
SO14 = smd 0.66 x 2.032: 1 -3.81,-3.073; 2 -2.54,-3.073; 3 -1.27,-3.073; 4 0,-3.073; 5 1.27,-3.073; 6 2.54,-3.073; 7 3.81,-3.073; 8 3.81,3.073; 9 2.54,3.073; 10 1.27,3.073; 11 0,3.073; 12 -1.27,3.073; 13 -2.54,3.073; 14 -3.81,3.073
SO08 = smd 0.6 x 2.2: 1 -1.905,-2.6; 2 -0.635,-2.6; 3 0.635,-2.6; 4 1.905,-2.6; 5 1.905,2.6; 6 0.635,2.6; 7 -0.635,2.6; 8 -1.905,2.6
SO14' = smd 0.6 x 2.2: 1 -3.81,-2.6; 2 -2.54,-2.6; 3 -1.27,-2.6; 4 0,-2.6; 5 1.27,-2.6; 6 2.54,-2.6; 7 3.81,-2.6; 8 3.81,2.6; 9 2.54,2.6; 10 1.27,2.6; 11 0,2.6; 12 -1.27,2.6; 13 -2.54,2.6; 14 -3.81,2.6
SF_ISC03_SOP254P1879X863-16N = smd 2.921 x 1.524: 1 -8.89,8.89; 2 -8.89,6.35; 7 -8.89,-6.35; 8 -8.89,-8.89; 9 8.89,-8.89; 10 8.89,-6.35; 16 8.89,8.89
SO-8 = smd 2.54 x 0.559: P$1 -2.54,1.905; P$2 -2.54,0.635; P$3 -2.54,-0.635; P$4 -2.54,-1.905; P$5 2.54,-1.905; P$6 2.54,-0.635; P$7 2.54,0.635; P$8 2.54,1.905
ASSR-1530_SO8 = smd 0.787 x 1.816: 1 -3.823,-3.327; 2 -1.283,-3.327; 3 1.257,-3.327; 4 3.797,-3.327; 5 3.797,3.302; 6 1.257,3.302; 7 -1.283,3.302; 8 -3.823,3.302
MSOP10 = smd 0.3 x 1: 1 -1,-2.05; 2 -0.5,-2.05; 3 0,-2.05; 4 0.5,-2.05; 5 1,-2.05; 6 1,2.05; 7 0.5,2.05; 8 0,2.05; 9 -0.5,2.05; 10 -1,2.05
VSSOP-10 = smd 1.5 x 0.3: 1 -2.25,1; 2 -2.25,0.5; 3 -2.25,0; 4 -2.25,-0.5; 5 -2.25,-1; 6 2.25,-1; 7 2.25,-0.5; 8 2.25,0; 9 2.25,0.5; 10 2.25,1
SOT-23 = smd 0.762 x 0.762: 1 -0.979,-1.101; 2 0.94,-1.101; 3 0.025,1.067
PT-SPIN = drill 0.813 pad 1.524 octagon: 1 -6.35,-1.27; 2 6.35,-1.27; 3 -1.27,1.27
M1206 = smd 1.6 x 2: 1 -1.4,0; 2 1.4,0
R2512 = smd 1.8 x 3.2: 1 -2.8,0; 2 2.8,0
SOT-23_MC = smd 0.61 x 1.321: 1 -0.95,-1.015; 2 0.95,-1.015; 3 0,1.015
UL_IRF9Z24_D2PAK = smd 1.041 x 3.505: 1 -2.54,-8.814; 3 2.54,-8.814 | smd 10.719 x 12.04: 2 0,0
H15ML = drill 1.6 pad 3 long: D6 -10.16,26.67; D10 -10.16,16.51; D14 -10.16,6.35; D18 -10.16,-3.81; D22 -10.16,-13.97; D26 -10.16,-24.13; D30 -10.16,-34.29; Z4 -5.08,31.75; Z8 -5.08,21.59; Z12 -5.08,11.43; Z16 -5.08,1.27; Z20 -5.08,-8.89; Z24 -5.08,-19.05; Z28 -5.08,-29.21; Z32 -5.08,-39.37 | hole 2.794: 0,-44.45; 0,44.45

### Placement (x,y rotation side)
C1  78.11,34.92 180 top
C2  78.11,37.47 180 top
C3  114.3,51.44 0 top
C4  18.41,15.24 270 top
C5  105.41,55.24 90 top
C6  20.95,15.24 270 top
C7  102.23,55.24 90 top
C8  99.69,55.24 90 top
C9  78.11,48.26 180 top
C10  114.3,62.87 0 top
C11  78.11,45.72 180 top
C12  105.41,66.67 90 top
C13  102.23,66.67 90 top
C14  23.5,51.44 90 top
C15  99.69,66.67 90 top
C16  26.04,51.44 90 top
C17  28.57,51.44 90 top
C18  40.01,36.2 270 top
C19  40.01,53.34 270 top
C20  42.55,36.2 270 top
C21  42.55,53.34 270 top
C22  45.09,36.2 270 top
C23  45.09,53.34 270 top
C24  8.89,27.94 180 top
C25  6.99,23.5 90 top
C26  116.84,38.1 270 top
C27  27.3,59.05 270 top
C28  8.89,33.02 180 top
C29  8.89,30.48 180 top
C30  36.83,44.45 90 top
C31  36.2,59.05 270 top
C32  27.3,67.94 270 top
C33  49.53,47.62 270 top
C34  82.55,81.92 90 top
C35  93.98,81.92 90 top
C36  68.58,82.55 0 top
C37  68.58,80.01 0 top
C38  119.38,92.08 90 top
C39  109.22,74.93 270 top
C40  116.2,92.08 90 top
C41  112.39,74.93 270 top
C42  109.22,92.08 90 top
C43  119.38,74.93 270 top
C44  112.39,92.08 90 top
C45  116.2,74.93 270 top
C46  105.41,88.27 90 top
C47  105.41,78.74 270 top
C48  102.23,78.74 270 top
C49  102.23,88.27 90 top
C50  52.07,30.48 180 top
C51  52.07,27.3 180 top
C52  59.69,27.3 180 top
C53  59.69,29.84 180 top
C54  59.69,32.38 180 top
C55  59.69,40.64 0 top
C56  59.69,43.18 0 top
C57  67.31,41.27 90 top
C58  59.69,45.72 0 top
C59  64.77,41.27 90 top
C60  84.45,26.04 270 top
C61  87,26.04 270 top
D1  114.3,87 180 top
D2  114.3,80.01 0 top
D3  66.04,36.83 180 top
IC1  87.63,40.01 90 top
IC2  87.63,50.8 90 top
IC3  26.67,15.24 0 top
IC4  25.4,44.45 0 top
IC5  OP484  [SO14']  42.55,44.45 0 top
IC6  107.95,33.02 0 top
IC7  15.88,30.48 270 top
IC8  90.17,69.85 0 top
IC9  78.74,69.85 0 top
IC10  55.88,36.2 0 top
IC11  79.38,26.04 0 top
Q1  45.09,59.05 270 top
R1  16.51,59.05 0 top
R2  30.48,59.05 270 top
R3  30.48,44.45 90 top
R4  33.66,44.45 270 top
R5  40.01,60.96 180 top
R6  40.01,57.15 180 top
R7  30.48,67.94 270 top
R8  16.51,67.94 0 top
R9  49.53,59.05 0 top
R10  68.58,76.83 180 top
R11  68.58,73.03 180 top
R12  69.85,86.36 0 top
R13  104.14,8.89 0 top
R14  119.38,8.89 0 top
R15  111.76,8.89 0 top
R16  41.91,12.06 90 top
R17  35.56,12.06 90 top
R18  38.73,12.06 90 top
R19  86.36,59.69 270 top
R20  90.17,59.69 270 top
R21  93.98,59.69 270 top
R22  82.55,59.69 270 top
R23  33.02,25.4 90 top
R24  29.21,25.4 90 top
R25  21.59,25.4 270 top
R26  25.4,25.4 270 top
U1  10.16,23.5 180 top
U2  52.07,78.74 90 top
X1  135.59,49.83 0 top

### Tracks (layer width: path | path; a pad name or v marks a point on that pad's centre or on a via)
1  (via drill 0.35)
  DigitalGND 0.406: IC3.6 v29.21,10.16 | IC1.9 v82.55,42.55 | IC1.4 v92.71,40.01 v95.25,40.01 | IC1.5 v92.71,41.27 | R17.2 v35.56,15.24
  DigitalSignal 0.406: v92.71,40.01 v92.71,41.27 87.63,41.27 86.36,42.55 v82.55,42.55 | v29.21,10.16 30.48,10.16 v35.56,15.24 | v61.59,16.51 93.98,16.51 95.25,17.78 v95.25,40.01
  AnalogSignal 0.406: v35.56,15.24 39.37,19.05 59.05,19.05 v61.59,16.51
2  (via drill 0.35)
  DigitalGND 0.406: IC3.4 v26.67,10.16 | IC1.13 v82.55,37.47 | IC1.1 v92.71,36.2 | IC1.2 v92.71,37.47 | R18.2 v38.73,15.24
  DigitalSignal 0.406: v82.55,37.47 v92.71,37.47 v92.71,36.2 93.98,34.92 93.98,19.05 92.71,17.78 60.96,17.78 v59.69,16.51 | v26.67,10.16 27.94,8.89 32.38,8.89 v38.73,15.24
  AnalogSignal 0.406: v38.73,15.24 41.27,17.78 58.42,17.78 v59.69,16.51
3  (via drill 0.35)
  DigitalGND 0.406: IC3.2 v24.13,10.16 | v82.55,38.73 IC1.12 87,38.73 87.63,38.1 v87.63,36.2 | IC1.10 v82.55,41.27 | v82.55,53.98 83.19,53.34 IC2.9 | IC2.12 v82.55,49.53 | R16.2 v41.91,15.24
  DigitalSignal 0.406: v82.55,41.27 80.64,41.27 | 80.64,41.27 80.01,41.91 80.01,48.9 80.64,49.53 | v82.55,49.53 80.64,49.53 | 80.64,49.53 80.01,50.16 80.01,53.34 80.64,53.98 v82.55,53.98 | 80.64,41.27 80.01,40.64 80.01,39.37 80.64,38.73 v82.55,38.73 | v24.13,10.16 26.67,7.62 34.29,7.62 v41.91,15.24 | v57.78,16.51 60.33,19.05 91.44,19.05 92.71,20.32 92.71,33.66 91.44,34.92 88.9,34.92 v87.63,36.2
  AnalogSignal 0.406: v41.91,15.24 43.18,16.51 v57.78,16.51
3&1  (via drill 0.35)
  DigitalGND 0.406: R20.1 v90.17,62.87 | IC8.2 v88.9,64.77
  DigitalSignal 0.406: v88.9,64.77 88.9,64.14 v90.17,62.87
3&2  (via drill 0.35)
  DigitalGND 0.406: R21.1 v93.98,62.87 | IC8.4 v93.98,64.77
  DigitalSignal 0.406: v93.98,62.87 v93.98,64.77
+3.3V  (via drill 0.35)
  DigitalGND 0.406: C29.1 v11.43,30.48 | C28.1 v11.43,33.02 | C24.1 v11.43,27.94 | U1.2 9.21,25.72 v9.53,26.04 | IC7.P$3 v15.24,34.92 | IC7.P$8 v17.78,26.04 | R26.1 v25.4,28.57
  DigitalSignal 0.406: v9.53,26.04 10.79,26.04 11.43,26.67 v11.43,27.94 v11.43,30.48 v11.43,33.02 11.43,35.56 12.06,36.2 14.61,36.2 15.24,35.56 v15.24,34.92 15.24,31.75 17.78,29.21 | 17.78,29.21 v17.78,26.04 | 17.78,29.21 21.3,29.21 21.32,29.23 24.74,29.23 v25.4,28.57
+5V  (via drill 0.35)
  DigitalGND 0.254: IC11.10 81.62,27.65 v81.92,27.94 | C60.1 v84.45,28.57 | C61.1 v87,28.57 | IC11.1 75.2,27.04 v74.93,27.3 | IC11.2 75.43,26.54 v74.93,26.04 | IC11.9 83.05,26.54 v83.19,26.67 | C1.1 v80.64,34.92 | C2.1 v80.64,37.47 | IC1.14 v82.55,36.2 | IC2.14 v82.55,46.99 | C11.1 v80.67,45.72 | C9.1 v80.67,48.26
  DigitalGND 0.406: IC3.14 v22.86,20.32 | C4.1 v18.41,18.41 | C6.1 v20.95,18.41 | IC4.8 v23.5,48.9 C14.1 | C16.1 v26.04,48.9 | C17.1 v28.57,48.9 | U1.3 v10.16,20.95 | C25.1 v6.99,20.95 | IC8.3 v91.44,64.77 | IC8.1 v86.36,64.77 | IC9.3 v80.01,64.77 | IC9.1 v74.93,64.77 | R16.1 v41.91,8.26 | R18.1 v38.73,8.26 | R17.1 35.56,8.89 v36.2,8.26 | R25.1 v21.59,28.57 | R24.2 v29.21,28.57 | R23.2 v33.02,28.57
  DigitalGND 1.27: IC6.9 v114.3,24.13 v113.03,24.13 v111.76,24.13
  DigitalSignal 0.254: v81.92,27.94 82.55,28.57 v84.45,28.57 v87,28.57 | v83.19,26.67 v81.92,27.94 | v81.92,27.94 75.56,27.94 v74.93,27.3 v74.93,26.04 | v82.55,36.2 81.92,36.2 | 81.92,36.2 v80.64,34.92 | v80.64,37.47 81.92,36.2 | v80.67,48.26 81.94,46.99 | 81.94,46.99 v82.55,46.99 | v80.67,45.72 81.94,46.99
  DigitalSignal 0.406: v22.86,20.32 21.59,20.32 20.95,19.68 v20.95,18.41 v18.41,18.41 | v6.99,20.95 v10.16,20.95
  AnalogSignal 0.406: v28.57,48.9 v26.04,48.9 v23.5,48.9
  AnalogSignal 1.27: 107.95,20.32 95.89,8.26 v41.91,8.26 v38.73,8.26 v36.2,8.26 19.68,8.26 18.41,9.53 v18.41,18.41 16.51,20.32 15.88,20.95 | 107.95,20.32 111.12,23.5 v111.76,24.13 | 15.88,20.95 v10.16,20.95 | 15.88,20.95 15.88,22.59 18.87,25.58 18.87,25.85 v21.59,28.57 23.5,30.48 27.3,30.48 v29.21,28.57 v33.02,28.57 | v23.5,48.9 8.26,48.9 | 8.26,48.9 5.08,45.72 5.08,22.86 v6.99,20.95 | v82.55,46.99 84.45,46.99 | 84.45,36.2 84.45,46.99 | v82.55,36.2 84.45,36.2 | 84.45,36.2 84.45,34.29 87,31.75 v87,28.57 94.61,20.95 107.31,20.95 107.95,20.32 | 84.45,46.99 84.45,53.98 83.19,55.24 81.28,55.24 77.47,59.05 77.47,60.33 | v80.01,64.77 79.38,64.14 77.47,62.23 | 77.47,62.23 77.47,60.33 | 77.47,62.23 v74.93,64.77 | v86.36,64.77 88.27,62.87 88.27,60.33 | v91.44,64.77 92.08,64.14 92.08,60.33 88.27,60.33 | 88.27,60.33 77.47,60.33 | R1.1 8.26,55.88 8.26,48.9
+20V  (via drill 0.35)
  DigitalGND 0.254: IC10.1 54.88,33.29 54.61,33.02 v53.98,33.02 | IC10.3 v55.88,31.75 | C50.1 v55.24,30.48 | C51.1 v55.24,27.3
  DigitalGND 0.406: C15.1 v99.69,62.87 | C13.1 v102.23,62.87 | C12.1 v105.41,62.87 | R9.2 v55.88,59.05 | R12.2 v74.93,86.36
  DigitalGND 1.27: C10.+ 118.75,63.16 v118.75,65.41 v118.75,66.67 v118.75,67.94
  DigitalSignal 1.27: v99.69,62.87 97.79,64.77 97.79,69.85 | 97.79,69.85 66.67,69.85 v55.88,59.05 52.7,55.88 52.7,38.1 v51.44,36.83 | v74.93,86.36 95.25,86.36 97.79,83.82 97.79,69.85
  AnalogSignal 0.254: v53.98,33.02 53.98,32.38 54.61,31.75 v55.88,31.75 55.88,31.11 v55.24,30.48 v55.24,27.3
  AnalogSignal 1.27: X1.Z8 122.22,71.42 v118.75,67.94 v118.75,66.67 v118.75,65.41 118.75,64.77 116.84,62.87 v105.41,62.87 v102.23,62.87 v99.69,62.87 | v51.44,36.83 51.44,35.56 v53.98,33.02
+24V  (via drill 0.35)
  DigitalGND 0.254: IC10.7 56.38,39.23 v56.52,39.37 | C55.1 v57.15,40.64 | C56.1 v57.15,43.18 | C58.1 v57.15,45.72
  DigitalGND 0.406: IC5.4 v42.55,40.01 | C18.1 v40.01,38.73 | C20.1 v42.55,38.73 | C22.1 v45.09,38.73 | C8.1 v99.69,51.44 | C7.1 v102.23,51.44 | C5.1 v105.41,51.44
  DigitalGND 1.27: 118.75,51.73 v118.75,56.52 | v116.84,46.35 IC6.16 C26.1
  DigitalGND 1.524: C3.+ 118.75,51.73
  DigitalSignal 1.27: v57.15,45.72 58.42,45.72 59.69,44.45 59.69,36.83 59.05,36.2 55.88,36.2 53.98,34.29 50.16,34.29 48.26,36.2 48.26,38.1 46.35,40.01 v42.55,40.01
  AnalogSignal 0.254: v57.15,45.72 v57.15,43.18 v57.15,40.64 57.15,40.01 v56.52,39.37
  AnalogSignal 0.406: v40.01,38.73 41.27,38.73 v42.55,40.01 | v42.55,38.73 v42.55,40.01 | v45.09,38.73 43.81,38.73 v42.55,40.01
  AnalogSignal 1.27: X1.D10 125.42,63.2 v118.75,56.52 v118.75,55.24 v118.75,53.98 118.75,53.34 116.84,51.44 | 116.84,51.44 v105.41,51.44 v102.23,51.44 v99.69,51.44 96.52,54.61 96.52,67.31 93.98,69.85 76.83,69.85 57.15,50.16 v57.15,45.72 | 116.84,51.44 v116.84,46.35 v116.84,45.09 v116.84,43.81
-5V  (via drill 0.35)
  DigitalGND 0.254: IC10.4 56.38,33.16 v57.15,32.38 C54.2 | C53.2 v57.15,29.84 | C52.2 v57.15,27.3
  DigitalGND 0.406: IC5.11 v42.55,48.9 | C21.2 v42.55,50.8 | C23.2 v45.09,50.8 | C19.2 v40.01,50.8 | C27.2 v27.3,56.52
  DigitalGND 1.27: IC6.10 v114.3,26.67 v113.03,26.67 v111.76,26.67
  DigitalSignal 0.406: v40.01,50.8 34.92,50.8 31.11,54.61 29.21,54.61 v27.3,56.52 26.04,57.78 R1.2
  DigitalSignal 1.27: v90.17,30.48 67.31,30.48 65.41,32.38 64.14,33.66 58.42,33.66 v57.15,32.38
  AnalogSignal 0.254: v57.15,27.3 v57.15,29.84 v57.15,32.38
  AnalogSignal 0.406: v40.01,50.8 41.27,50.8 42.55,49.53 | 42.55,49.53 v42.55,48.9 | v42.55,50.8 42.55,49.53 | v45.09,50.8 43.81,50.8 42.55,49.53
  AnalogSignal 1.27: v42.55,48.9 42.55,46.35 48.26,40.64 50.8,40.64 57.15,34.29 v57.15,32.38 | v111.76,26.67 111.12,26.67 107.31,30.48 v90.17,30.48
ADC-CS  (via drill 0.35)
  DigitalGND 0.406: v31.11,24.13 31.11,22.76 29.21,20.85 IC3.9
  DigitalSignal 0.406: X1.D22 125.42,33.98 120.02,28.57 120.02,21.59 111.12,12.7 55.88,12.7 43.81,24.77 31.75,24.77 v31.11,24.13
AGND  (via drill 0.35)
  DigitalGND 0.254: v62.23,32.38 C54.1 60.79,33.19 59.84,34.15 IC10.5 | C53.1 v62.23,29.84 | C52.1 v62.23,27.3 | C51.2 v48.9,27.3 | C50.2 v48.9,30.48
  DigitalGND 0.406: IC7.P$2 v16.51,34.92 | IC4.4 v27.3,40.01 | C18.2 v40.01,33.66 | C20.2 v42.55,33.66 | C22.2 v45.09,33.66 | C32.2 v27.3,65.41 | IC9.7 77.46,74.92 v77.47,74.93 | IC8.7 88.9,73.17 v88.9,74.93 | C15.2 v99.69,69.85 | C13.2 v102.23,69.85 | C12.2 v105.41,69.85 | C5.2 v105.41,58.42 | C7.2 v102.23,58.42 | C8.2 v99.69,58.42 | C39.2 v109.22,71.75 | C41.2 v112.39,71.75 | C45.2 v116.2,71.75 | C43.2 v119.38,71.75 | C47.2 v105.41,75.56 | C48.2 v102.23,75.56 | C49.2 v102.23,91.44 | C46.2 v105.41,91.44 | C42.2 v109.22,95.25 | C44.2 v112.39,95.25 | C40.2 v116.2,95.25 | C38.2 v119.38,95.25 | C34.2 84.28,83.02 v84.45,83.19 | v95.89,81.28 95.89,82.38 95.25,83.02 C35.2 | C36.2 v71.12,82.55 | C37.2 v71.12,80.01 | C14.2 v23.5,53.98 | C16.2 v26.04,53.98 | C17.2 v28.57,53.98 | C30.2 v36.83,46.99 | C58.2 v62.23,45.72 | C56.2 v62.23,43.18 | C55.2 v62.23,40.64 | C59.2 v64.77,43.81 | C57.2 v67.31,43.81 | C19.1 38.27,54.44 v38.1,54.61 | C21.1 42.55,55.24 v43.18,55.88 | C23.1 45.26,54.61 v46.99,54.61 | C26.2 v116.84,35.56
  DigitalGND 1.27: C3.- 110.49,51.77 v110.49,53.98 v110.49,55.24 v110.49,56.52 | C10.- 110.49,63.2 v110.49,65.41 v110.49,66.67 v110.49,67.94
  pour AnalogGND (rank 2): -1.91,101.6 -1.91,-1.91 140.97,-1.91 140.97,101.6
CLK  (via drill 0.35)
  DigitalGND 0.406: IC3.11 v26.67,20.32 | IC7.P$5 v13.97,26.04
  DigitalSignal 0.406: v26.67,20.32 26.67,19.05 27.3,18.41 | 27.3,18.41 29.84,18.41 31.75,20.32 44.45,20.32 54.61,10.16 112.39,10.16 125.42,23.19 X1.D26 | v13.97,26.04 13.97,16.51 15.24,15.24 25.4,15.24 26.67,16.51 26.67,17.78 27.3,18.41
DAC-CS  (via drill 0.35)
  DigitalGND 0.406: IC7.P$4 v13.97,34.92
  DigitalSignal 0.406: X1.Z20 123.5,40.95 121.28,38.73 121.28,31.75 118.75,29.21 118.75,22.23 110.49,13.97 56.52,13.97 44.45,26.04 20.95,26.04 18.41,23.5 15.88,23.5 15.24,24.13 15.24,29.21 13.97,30.48 v13.97,34.92
DGND
  pour DigitalGND (rank 2): -1.27,100.97 -1.27,-1.27 140.34,-1.27 140.34,100.97
GND  (via drill 0.35)
  other vias: 2.54,1.91 5.08,1.91 7.62,1.91 10.16,1.91 12.7,1.91 15.24,1.91 17.78,1.91 20.32,1.91 22.86,1.91 25.4,1.91 27.94,1.91 30.48,1.91 33.02,1.91 35.56,1.91 38.1,1.91 43.18,1.91 40.64,1.91 45.72,1.91 48.26,1.91 50.8,1.91 53.34,1.91 55.88,1.91 58.42,1.91 60.96,1.91 63.5,1.91 66.04,1.91 68.58,1.91 71.12,1.91 73.66,1.91 76.2,1.91 78.74,1.91 81.28,1.91 83.82,1.91 86.36,1.91 88.9,1.91 91.44,1.91 93.98,1.91 96.52,1.91 99.06,1.91 104.14,1.91 101.6,1.91 106.68,1.91 109.22,1.91 111.76,1.91 114.3,1.91 116.84,1.91 119.38,1.91 121.92,1.91 124.46,1.91 127,1.91 132.08,1.91 129.54,1.91 2.54,4.45 2.54,6.99 2.54,9.53 2.54,12.06 2.54,14.61 2.54,17.14 2.54,19.68 2.54,22.23 2.54,24.77 2.54,27.3 2.54,29.84 2.54,32.38 2.54,34.92 2.54,37.47 2.54,40.01 2.54,42.55 2.54,45.09 2.54,47.62 2.54,50.16 2.54,52.7 2.54,55.24 2.54,57.78 2.54,60.33 2.54,62.87 2.54,65.41 2.54,70.48 2.54,67.94 2.54,73.03 2.54,75.56 2.54,80.64 2.54,83.19 2.54,85.72 2.54,88.27 2.54,78.11 2.54,90.81 2.54,93.34 2.54,95.89 5.08,98.42 7.62,98.42 10.16,98.42 12.7,98.42 15.24,98.42 17.78,98.42 20.32,98.42 22.86,98.42 25.4,98.42 27.94,98.42 30.48,98.42 33.02,98.42 35.56,98.42 38.1,98.42 40.64,98.42 43.18,98.42 45.72,98.42 48.26,98.42 50.8,98.42 53.34,98.42 55.88,98.42 58.42,98.42 60.96,98.42 63.5,98.42 66.04,98.42 68.58,98.42 71.12,98.42 73.66,98.42 76.2,98.42 78.74,98.42 81.28,98.42 83.82,98.42 86.36,98.42 88.9,98.42 91.44,98.42 93.98,98.42 96.52,98.42 99.06,98.42 101.6,98.42 104.14,98.42 106.68,98.42 109.22,98.42 111.76,98.42 114.3,98.42 116.84,98.42 119.38,98.42 121.92,98.42 124.46,98.42 127,98.42 129.54,98.42 132.08,98.42 132.08,96.52 132.08,93.98 135.89,88.9 135.89,86.36 135.89,83.82 135.89,81.28 135.89,78.74 135.89,76.2 135.89,73.66 135.89,71.12 135.89,68.58 135.89,66.04 135.89,63.5 135.89,60.96 135.89,58.42 135.89,55.88 135.89,53.34 135.89,50.8 135.89,48.26 135.89,45.72 135.89,43.18 135.89,40.64 135.89,38.1 135.89,35.56 135.89,33.02 135.89,30.48 135.89,27.94 135.89,25.4 135.89,22.86 135.89,20.32 135.89,17.78 135.89,15.24 135.89,12.7 135.89,10.16 134.62,8.89 133.35,7.62 132.08,6.35 132.08,5.08 132.08,3.81 134.62,90.17 133.35,91.44 132.08,92.71
  pour DigitalGND (rank 2): 137.79,0.64 137.79,99.06 137.79,99.69
  pour DigitalGND (rank 2): 0,0 0,99.06 3.81,99.06 3.81,0
  pour AnalogGND (rank 2): 0,0 0,99.06 3.81,99.06 3.81,0
  pour AnalogGND (rank 2): 128.27,3.81 134.62,10.16 134.62,11.43 137.16,11.43 137.16,0 0,0 0,3.81
  pour DigitalGND (rank 2): 135.89,11.43 137.16,11.43 137.16,0 0,0 0,3.81 128.27,3.81
  pour AnalogGND (rank 2): 134.62,88.9 135.89,90.17 137.16,88.9 137.16,10.16 134.62,10.16
  pour DigitalGND (rank 2): 134.62,10.16 137.16,10.16 137.16,88.9 135.89,90.17 134.62,88.9
  pour DigitalGND (rank 2): 134.62,88.9 129.54,93.98 129.54,96.52 58.42,96.52 57.78,95.89 2.54,95.89 2.54,99.06 137.16,99.06 137.16,88.9
  pour AnalogGND (rank 2): 134.62,88.9 129.54,93.98 129.54,96.52 2.54,96.52 2.54,99.06 137.16,99.06 137.16,88.9
H-BDG  (via drill 0.35, 1.52)
  DigitalGND 0.254: 93.97,76.2 v93.98,76.2 | 93.97,77.47 v93.98,77.47 | 82.54,77.47 v82.55,77.47
  DigitalGND 0.406: C34.1 v82.55,78.74 | C35.1 v93.98,78.74
  DigitalGND 0.762: IC9.5 v82.54,76.2 82.54,77.47 82.54,78.73 v82.55,78.74 | IC8.5 93.97,76.2 93.97,77.47 93.97,78.73 v93.98,78.74
  DigitalGND 1.27: U2.2 v60.96,78.74
  DigitalSignal 1.27: v60.96,78.74 v82.55,78.74 | v82.55,78.74 v93.98,78.74 v93.98,77.47 v93.98,76.2 | v82.55,78.74 v82.55,77.47 82.55,76.21 v82.54,76.2
  other vias: 6.99,75.56 6.99,79.38 6.99,83.19 6.99,87 6.99,90.81 6.99,94.61 10.79,75.56 10.79,79.38 10.79,83.19 10.79,87 10.79,90.81 10.79,94.61 14.61,75.56 14.61,79.38 14.61,83.19 14.61,87 14.61,90.81 14.61,94.61 18.41,75.56 18.41,79.38 18.41,83.19 18.41,87 18.41,90.81 18.41,94.61 22.23,75.56 22.23,79.38 22.23,83.19 22.23,87 22.23,90.81 22.23,94.61 26.04,75.56 26.04,79.38 26.04,83.19 26.04,87 26.04,90.81 26.04,94.61 29.84,75.56 29.84,79.38 29.84,83.19 29.84,87 29.84,90.81 29.84,94.61 33.66,75.56 33.66,79.38 33.66,83.19 33.66,87 33.66,90.81 33.66,94.61 37.47,75.56 37.47,79.38 37.47,83.19 37.47,87 37.47,90.81 37.47,94.61 41.27,75.56 41.27,79.38 41.27,83.19 41.27,87 41.27,90.81 41.27,94.61 45.09,87 45.09,90.81 45.09,94.61 48.9,87 48.9,90.81 48.9,94.61 52.7,87 52.7,90.81 52.7,94.61 56.52,87 56.52,90.81 56.52,94.61
  pour DigitalGND (isolate 0.406): 58.42,74.3 58.42,95.89 57.15,97.16 5.71,97.16 4.45,95.89 4.45,74.3 5.71,73.03 57.15,73.03
  pour AnalogGND (isolate 0.406): 5.71,97.16 4.45,95.89 4.45,74.3 5.71,73.03 57.15,73.03 58.42,74.3 58.42,95.89 57.15,97.16
H-EN  (via drill 0.35)
  DigitalGND 0.406: IC3.1 v22.86,10.16 | R13.2 v107.31,8.89
  DigitalSignal 0.406: v22.86,10.16 22.86,12.06 24.13,13.34 26.67,13.34 32.38,19.05 43.81,19.05 53.98,8.89 v107.31,8.89 113.03,8.89 124.77,20.62 X1.Z28
H-NEG  (via drill 0.35)
  DigitalGND 0.406: IC3.3 v25.4,10.16 | R15.2 v114.94,8.89
  DigitalSignal 0.406: v25.4,10.16 33.02,17.78 43.18,17.78 53.34,7.62 113.67,7.62 v114.94,8.89 121.59,15.54 X1.D30
H-POS  (via drill 0.35)
  DigitalGND 0.406: IC3.5 v27.94,10.16 | R14.2 v122.56,8.89
  DigitalSignal 0.406: v27.94,10.16 27.94,10.79 33.66,16.51 42.55,16.51 52.7,6.35 120.02,6.35 v122.56,8.89 124.13,10.46 X1.Z32
LOAD_N  (via drill 0.35)
  DigitalGND 0.508: D2.3 v114.3,82.55
  DigitalGND 0.762: IC8.8 86.35,77.46 v86.36,77.47 | IC8.6 91.43,77.46 v91.44,77.47
  DigitalGND 1.27: C48.1 v102.23,82.55 | C47.1 v105.41,82.55
  AnalogSignal 1.27: X1.D6 124.16,76.5 118.11,82.55 v114.3,82.55 v105.41,82.55 v102.23,82.55 91.44,82.55 88.9,80.01 | 88.9,80.01 v86.36,77.47 v86.36,76.2 v86.36,74.93 | 88.9,80.01 v91.44,77.47 v91.44,76.2 v91.44,74.93
LOAD_P  (via drill 0.35)
  DigitalGND 0.508: D1.3 v114.3,84.45
  DigitalGND 0.762: IC9.8 74.92,74.92 v74.93,74.93 v74.93,76.2 v74.93,77.47 | IC9.6 80,74.92 v80.01,74.93 v80.01,76.2 v80.01,77.47
  DigitalGND 1.27: C49.1 v102.23,84.45 | C46.1 v105.41,84.45
  AnalogSignal 1.27: X1.Z4 122.25,81.58 119.38,84.45 v114.3,84.45 v105.41,84.45 v102.23,84.45 81.92,84.45 77.47,80.01 | v80.01,74.93 v80.01,76.2 v80.01,77.47 77.47,80.01 | v74.93,74.93 v74.93,76.2 v74.93,77.47 77.47,80.01
LSENSE  (via drill 0.35)
  DigitalGND 0.254: IC10.10 54.88,39.1 v54.61,39.37 | IC10.8 v55.88,40.01
  DigitalGND 0.406: U2.3 v63.5,81.28 | C36.1 v66.04,82.55 | R12.1 v65.41,86.36 | C37.1 v66.04,80.01 | R10.2 v65.41,76.83
  AnalogSignal 0.406: v66.04,82.55 64.77,82.55 v63.5,81.28 | v63.5,81.28 63.5,84.45 v65.41,86.36 70.48,86.36 72.39,84.45 72.39,78.74 72.39,67.94 67.31,62.87 55.88,62.87 54.61,61.59 v54.61,39.37 55.24,40.01 v55.88,40.01 | v66.04,80.01 64.77,80.01 v63.5,81.28 | v65.41,76.83 63.5,78.74 v63.5,81.28
MISO  (via drill 0.35)
  DigitalGND 0.406: R26.2 v25.4,22.23 | IC3.12 v25.4,20.32
  DigitalSignal 0.406: v25.4,20.32 v25.4,22.23 27.3,22.23 27.94,22.86 43.81,22.86 55.24,11.43 111.76,11.43 121.28,20.95 121.28,27.94 124.13,30.79 X1.Z24
MOSI  (via drill 0.35)
  DigitalGND 0.406: v16.51,24.77 15.24,26.04 IC7.P$6
  DigitalSignal 0.406: X1.D18 125.42,44.78 120.02,39.37 120.02,32.38 117.47,29.84 117.47,22.86 109.86,15.24 57.15,15.24 45.09,27.3 20.32,27.3 17.78,24.77 v16.51,24.77
N$1  (via drill 0.35)
  DigitalGND 0.254: IC10.6 57.02,38.1 v57.78,38.1 | IC11.3 76.2,26.04 v75.56,25.4
  DigitalGND 0.406: D3.3 v66.04,34.29
  AnalogSignal 0.406: v57.78,38.1 57.78,35.56 59.05,34.29 v66.04,34.29 71.75,34.29 73.03,33.02 73.03,25.4 73.66,24.77 74.93,24.77 v75.56,25.4
N$2  (via drill 0.35)
  DigitalGND 0.406: R6.1 42.55,57.15 43.51,58.12 Q1.2 44.62,58.12 45.58,57.15 v45.72,57.15 | v30.48,64.77 R7.2
  AnalogSignal 0.406: v45.72,57.15 45.72,62.87 43.81,64.77 v30.48,64.77
N$3  (via drill 0.35)
  DigitalGND 0.254: IC11.6 81.62,24.42 v81.92,24.13
  DigitalGND 0.406: R23.1 v33.02,21.59 | IC3.8 v30.48,20.32
  DigitalSignal 0.406: v30.48,20.32 31.75,21.59 v33.02,21.59 v43.18,21.59 | v53.98,20.32 80.64,20.32 81.92,21.59 v81.92,24.13
  AnalogSignal 0.406: v43.18,21.59 44.45,20.32 v53.98,20.32
N$4  (via drill 0.35)
  DigitalGND 0.254: IC11.8 80.01,26.04 79.38,25.4 79.38,22.86 v78.74,22.23
  DigitalGND 0.406: v28.57,21.59 29.21,22.23 R24.1 | IC3.10 v27.94,20.32
  DigitalSignal 0.406: v28.57,21.59 27.94,20.95 v27.94,20.32 | v78.74,22.23 78.11,21.59 v54.61,21.59
  AnalogSignal 0.406: v28.57,21.59 29.84,22.86 43.81,22.86 45.09,21.59 v54.61,21.59
N$5
  DigitalGND 0.406: Q1.1 43.47,60.03 42.55,60.96 R5.1
N$6  (via drill 0.35)
  DigitalGND 0.406: IC1.6 v92.71,42.55 | IC2.10 v82.55,52.07
  DigitalSignal 0.406: v92.71,42.55 88.27,42.55 86.68,44.13 86.68,44.77 87.63,45.72 87.63,50.8 86.36,52.07 v82.55,52.07
N$7  (via drill 0.35)
  DigitalGND 0.406: IC1.3 v93.98,38.73 | IC2.13 v82.55,48.26
  DigitalSignal 0.406: v93.98,38.73 94.3,39.05 94.3,45.4 v94.61,45.72 | v82.55,48.26 v86.36,48.26
  AnalogSignal 0.406: v94.61,45.72 88.9,45.72 v86.36,48.26
N$8  (via drill 0.35)
  DigitalGND 0.254: IC11.7 80.78,25.54 80.01,24.77 v80.01,21.59
  DigitalGND 0.406: R25.2 v21.59,22.23 | IC3.13 v24.13,20.32
  DigitalSignal 0.406: v21.59,22.23 22.86,22.23 24.13,20.95 v24.13,20.32 | v80.01,21.59 80.01,22.86 79.38,23.5 78.11,23.5 77.47,22.86 v55.24,22.86
  AnalogSignal 0.406: v55.24,22.86 45.72,22.86 44.45,24.13 35.56,24.13 34.27,25.42 23.52,25.42 21.59,23.5 v21.59,22.23
N$9  (via drill 0.35)
  DigitalGND 0.406: IC5.14 v38.73,48.9 | R5.2 37.8,60.16 C31.1 34.46,60.16 v34.29,60.33
  AnalogSignal 0.406: v34.29,60.33 34.29,53.34 v38.73,48.9
N$10  (via drill 0.35)
  DigitalGND 0.406: IC4.3 v26.04,40.01 | IC7.P$1 v17.78,34.92
  AnalogSignal 0.406: v26.04,40.01 26.04,36.2 24.77,34.92 v17.78,34.92
N$11  (via drill 0.35)
  DigitalGND 0.406: IC5.10 v43.81,48.9 | Q1.3 46.18,59.05 R9.1 48.13,57.28 v48.26,57.15
  AnalogSignal 0.406: v48.26,57.15 48.26,52.7 45.7,50.14 44.43,50.14 43.81,49.53 v43.81,48.9
N$13  (via drill 0.35)
  DigitalGND 0.406: U2.1 60.96,76.12 v60.96,74.3 | v65.41,73.03 R11.2
  AnalogSignal 0.406: v60.96,74.3 62.23,73.03 v65.41,73.03
N$14  (via drill 0.35)
  DigitalGND 0.406: IC5.13 v40.01,48.9 | R6.2 37.8,57.95 C31.2 v36.2,56.52
  AnalogSignal 0.406: v36.2,56.52 36.2,53.34 40.01,49.53 v40.01,48.9
N$15  (via drill 0.35)
  DigitalGND 0.406: v47.62,46.99 46.41,46.99 IC5.8 | C33.2 v49.53,45.09 | R11.1 69.85,72.89 v69.85,71.12
  AnalogSignal 0.406: v47.62,46.99 47.62,45.72 48.26,45.09 v49.53,45.09 51.44,45.09 52.7,46.35 52.7,62.23 55.24,64.77 66.67,64.77 69.85,67.94 v69.85,71.12
N$16
  DigitalGND 0.508: D1.1 115.25,89.72 C40.1 C38.1
N$17  (via drill 0.35)
  DigitalGND 0.406: IC5.12 v41.27,48.9 | R4.2 33.95,43.35 C30.1 v36.83,41.91
  AnalogSignal 0.406: v41.27,48.9 41.27,45.09 40.64,44.45 37.47,44.45 36.83,43.81 v36.83,41.91
N$18  (via drill 0.35)
  DigitalGND 0.406: R7.1 v30.48,71.12 | C32.1 v27.3,71.12
  AnalogSignal 0.406: v30.48,71.12 v27.3,71.12 24.77,71.12 22.86,69.22 | 22.86,69.22 R8.2 | R8.3 22.86,69.22
N$20  (via drill 0.35)
  DigitalGND 0.406: IC5.9 v45.09,48.9 | C33.1 v49.53,50.16 | R10.1 69.85,76.7 v69.85,74.93
  AnalogSignal 0.406: v45.09,48.9 45.72,48.9 46.99,50.16 v49.53,50.16 50.8,51.44 50.8,62.87 54.61,66.67 66.04,66.67 67.31,67.94 67.31,74.3 67.94,74.93 v69.85,74.93
N$21  (via drill 0.35)
  DigitalGND 0.406: R2.1 v30.48,62.23 | C27.1 v27.3,62.23
  AnalogSignal 0.406: v30.48,62.23 v27.3,62.23 17.14,62.23 R1.3
N$22
  DigitalGND 0.508: C42.1 C44.1 113.35,89.72 D1.2
N$23  (via drill 0.35)
  DigitalGND 0.406: IC1.8 87,43.81 v87.63,44.45 | IC2.4 v92.71,50.8 | IC2.5 v92.71,52.07
  DigitalSignal 0.406: v92.71,52.07 v92.71,50.8 88.9,50.8 88.27,50.16 88.27,45.09 v87.63,44.45
N$24  (via drill 0.35)
  DigitalGND 0.406: IC1.11 v82.55,40.01 | IC2.1 v92.71,46.99 | IC2.2 v92.71,48.26
  DigitalSignal 0.406: v92.71,48.26 v92.71,46.99 93.34,46.35 93.34,42.84 93.37,42.82 93.37,39.39 92.71,38.73 88.9,38.73 87.63,40.01 v82.55,40.01
N$25  (via drill 0.35)
  DigitalGND 0.406: v85.09,55.88 84.56,55.35 IC2.8 | R19.2 v86.36,56.52
  DigitalSignal 0.406: v85.09,55.88 85.72,55.88 v86.36,56.52
N$26  (via drill 0.35)
  DigitalGND 0.406: IC2.6 v92.71,53.34 | R20.2 v90.17,56.52
  DigitalSignal 0.406: v90.17,56.52 91.44,56.52 92.71,55.24 v92.71,53.34
N$27  (via drill 0.35)
  DigitalGND 0.406: IC2.3 v92.71,49.53 | R21.2 v93.98,56.52
  DigitalSignal 0.406: v93.98,56.52 93.98,50.8 v92.71,49.53
N$28  (via drill 0.35)
  DigitalGND 0.406: R4.1 R3.2 30.35,45.72 29.21,45.72 v28.57,45.09 | IC4.1 v23.5,40.01
  AnalogSignal 0.406: v28.57,45.09 24.77,45.09 23.5,43.81 v23.5,40.01
N$29  (via drill 0.35)
  DigitalGND 0.406: IC2.11 v82.55,50.8 | R22.2 v82.55,56.52
  DigitalSignal 0.406: v82.55,50.8 82.23,50.8 81.6,51.44 81.6,52.39 82.23,53.02 83.19,53.02 83.82,53.66 83.82,55.88 83.19,56.52 v82.55,56.52
N$30
  DigitalGND 0.508: D2.1 113.35,77.28 C41.1 C39.1
N$32
  DigitalGND 0.508: D2.2 115.25,77.28 C45.1 C43.1
N$33
  DigitalGND 0.406: D3.1 66.99,39.05 67.31,39.37 C57.1
N$34
  DigitalGND 0.406: D3.2 65.09,39.05 64.77,39.37 C59.1
N$37  (via drill 0.35)
  DigitalGND 0.406: IC4.2 v24.77,40.01 | v28.57,43.81 29.21,43.18 30.35,43.18 R3.1 | R2.2 v30.48,55.88
  AnalogSignal 0.406: v24.77,40.01 24.77,43.18 25.4,43.81 v28.57,43.81 30.48,45.72 v30.48,55.88
~3||1  (via drill 0.35)
  DigitalGND 0.406: R19.1 v86.36,62.87 | IC9.4 v82.55,64.77
  DigitalSignal 0.406: v86.36,62.87 83.82,62.87 82.55,64.14 v82.55,64.77
~3||2  (via drill 0.35)
  DigitalGND 0.406: v82.55,62.87 R22.1 | IC9.2 77.46,64.78 v77.47,64.77
  DigitalSignal 0.406: v82.55,62.87 78.74,62.87 77.47,64.14 v77.47,64.77

### Text on the board
tPlace: OUTPUT | ANALOG | POWER | DIGITAL
tNames: SLOPE | INTRC
tDocu: 5.45 INCHES | 3.936 INCHES STANDARD EUROCARD | Copyright 2021, Matthew Gaines, MeRCIS LABS, CWRU
bDocu: Revision P / Joseph Cressman, Matthew Gaines / Sung Yoon Jung, Julian Narvaez, / Hangxing Liu, David Lituchy, / Samuel Xu, Mac Russell, & / Reinhardt G. "KAM" CRISS / MeRCIS LABS / Case Western Reserve University | DIMENSION INSIDE THIS RECTANGLE PLEASE